# Altium project EASY-EAI-Nano-TB V1.01.PrjPcb (part 2 of 4)

## Sheet 13.WDT.SchDoc
size A4; CheckedBy: YPC; DocumentNumber: 13; Revision: V1.00; SheetNumber: 13; SheetTotal: 18; SheetName: WDT; SheetDescribe: SheetDescribe; Designer: JOW; DesignDate: 2025-04-10; CheckedData: 2025-04-10
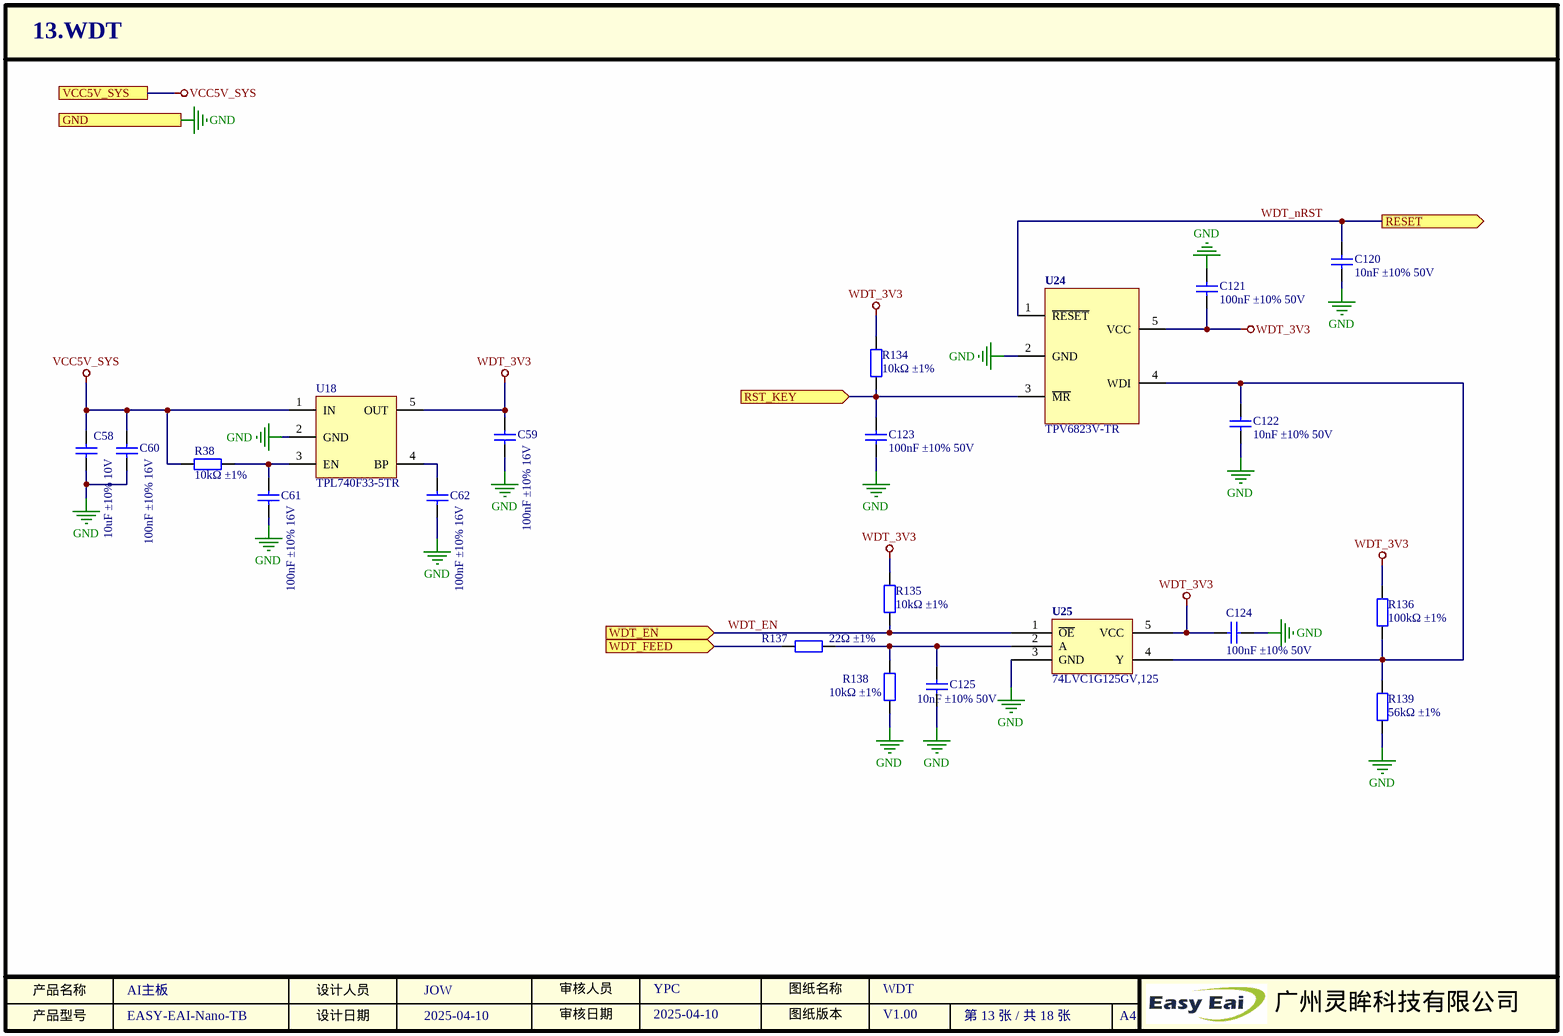
[diagram p5: 13.WDT.SchDoc]

### Parts
C58  描述: 10uF ±10% 10V  [0603_C]  (hidden comment: CL10A106KP8NNNC)
C59  描述: 100nF ±10% 16V  [0402_C]  (hidden comment: CL05B104KO5NNNC)
C60  描述: 100nF ±10% 16V  [0402_C]  (hidden comment: CL05B104KO5NNNC)
C61  描述: 100nF ±10% 16V  [0402_C]  (hidden comment: CL05B104KO5NNNC)
C62  描述: 100nF ±10% 16V  [0402_C]  (hidden comment: CL05B104KO5NNNC)  (no BOM)
C120  描述: 10nF ±10% 50V  [0402_C]  (hidden comment: CL05B103KB5NNNC)
C121  描述: 100nF ±10% 50V  [0402_C]  (hidden comment: GRM155R71H104KE14D)
C122  描述: 10nF ±10% 50V  [0402_C]  (hidden comment: CL05B103KB5NNNC)
C123  描述: 100nF ±10% 50V  [0402_C]  (hidden comment: GRM155R71H104KE14D)
C124  描述: 100nF ±10% 50V  [0402_C]  (hidden comment: GRM155R71H104KE14D)
C125  描述: 10nF ±10% 50V  [0402_C]  (hidden comment: CL05B103KB5NNNC)
R38  描述: 10kΩ ±1%  [0402_R]  (hidden comment: 0402WGF1002TCE)
R134  描述: 10kΩ ±1%  [0402_R]  (hidden comment: 0402WGF1002TCE)
R135  描述: 10kΩ ±1%  [0402_R]  (hidden comment: 0402WGF1002TCE)
R136  描述: 100kΩ ±1%  [0402_R]  (hidden comment: 0402WGF1003TCE)
R137  描述: 22Ω ±1%  [0402_R]  (hidden comment: 0402WGF220JTCE)
R138  描述: 10kΩ ±1%  [0402_R]  (hidden comment: 0402WGF1002TCE)
R139  描述: 56kΩ ±1%  [0402_R]  (hidden comment: 0402WGF5602TCE)
U18  TPL740F33-5TR  [SOT-23-5]
U24  TPV6823V-TR  [SOT-23-5]
U25  74LVC1G125GV,125  [SOT-23-5]

### Ports
GND, RESET (out), RST_KEY (in), VCC5V_SYS, WDT_EN (in), WDT_FEED (in)

### Nets
GND: C58.1 C59.1 C60.1 C61.1 C62.1 C120.1 C121.2 C122.1 C123.2 C124.1 C125.1 R138.1 R139.1 U18.2(GND) U24.2(GND) U25.3(GND) ; port GND  [project net CHIP_GND]
VCC5V_SYS: C58.2 C60.2 R38.1 U18.1(IN) ; port VCC5V_SYS
WDT_3V3: C59.2 C121.1 C124.2 R134.2 R135.2 R136.2 U18.5(OUT) U24.5(VCC) U25.5(VCC)
WDT_EN: R135.1 U25.1(~{OE}) ; port WDT_EN
WDT_nRST: C120.2 U24.1(~{RESET}) ; port RESET  [project net RESET]
NetC61_2: C61.2 R38.2 U18.3(EN)
NetC62_2: C62.2 U18.4(BP)
NetC122_2: C122.2 R136.1 R139.2 U24.4(WDI) U25.4(Y)
NetC123_1: C123.1 R134.1 U24.3(~{MR}) ; port RST_KEY
NetC125_2: C125.2 R137.2 R138.2 U25.2(A)
NetR137_1: R137.1 ; port WDT_FEED

### Notes on the sheet
- 产品名称
- 产品型号
- 设计人员
- 设计日期
- 审核人员
- 审核日期
- 图纸版本
- 图纸名称
- A4
- 广州灵眸科技有限公司

### Library data of the parts
C58 = 0603 10uF ±10% 10V: as C134 on sheet 14.Power_DCIN; 型号: CL10A106KP8NNNC; SuppliersPartNumber: C19702; 商品编号: SPZL000260
C59-C62 = 0402 100nF ±10% 16V: as C131 on sheet 14.Power_DCIN; 型号: CL05B104KO5NNNC; SuppliersPartNumber: C1525; 商品编号: SPZL000259
C120 C122 C125 = 0402 10nF ±10% 50V: as C130 on sheet 14.Power_DCIN; 型号: CL05B103KB5NNNC; SuppliersPartNumber: C15195; 商品编号: SPZL000342
C121 C123 C124 = 0402 100nF ±10% 50V: SPZL001162; 名称: 贴片电容; 厂商: muRata(村田); 封装: 0402; 工作温度: -55~125℃; 贴片和直插: SMD; 型号: GRM155R71H104KE14D; SuppliersPartNumber: C77020; 商品编号: SPZL001162
R38 R134 R135 R138 = 0402 10kΩ ±1%: as R141 on sheet 14.Power_DCIN; SuppliersPartNumber: C25744; 型号: 0402WGF1002TCE; 商品编号: SPZL000271
R136 = 0402 100kΩ ±1%: as R144 on sheet 14.Power_DCIN; SuppliersPartNumber: C25741; 型号: 0402WGF1003TCE; 商品编号: SPZL000282
R137 = 0402 22Ω ±1%: SPZL000279; 封装: 0402; 厂商: UNI-ROYAL(厚声); 贴片和直插: SMD; 名称: 电阻; 工作温度: -55~155℃; SuppliersPartNumber: C25092; 型号: 0402WGF220JTCE; 商品编号: SPZL000279
R139 = 0402 56kΩ ±1%: SPZL000395; 封装: 0402; 厂商: UNI-ROYAL(厚声); 贴片和直插: SMD; 名称: 电阻; 工作温度: -55~155℃; SuppliersPartNumber: C25796; 型号: 0402WGF5602TCE; 商品编号: SPZL000395
U18 = TPL740F33-5TR: SPZL000784; 名称: 电源IC; 厂商: 3PEAK; 贴片和直插: SMD; 描述: LDO; 工作温度: -40~85℃; 封装: SOT-23-5; SuppliersPartNumber: *; 商品编号: SPZL000784; 型号: TPL740F33-5TR
U24 = TPV6823V-TR: SPZL000751; 名称: IC; 封装: SOT23-5; 厂商: 3PEAK; 贴片和直插: SMD; 描述: 1.8V看门狗芯片; 工作温度: -40~125℃; 商品编号: SPZL000751; 型号: TPV6823V-TR
U25 = 74LVC1G125GV,125: SPZL000608; 名称: IC; 封装: SOT-753; 厂商: Nexperia(安世); 贴片和直插: SMD; 描述: 缓冲器; 工作温度: -40~85℃; SuppliersPartNumber: C12518; 商品编号: SPZL000608; 型号: 74LVC1G125GV,125

## Sheet 17.Other.SchDoc
size A4; CheckedBy: YPC; DocumentNumber: 17; Revision: V1.00; SheetNumber: 17; SheetTotal: 18; SheetName: Other; SheetDescribe: other; Designer: JOW; DesignDate: 2025-04-25; CheckedData: 2025-04-25
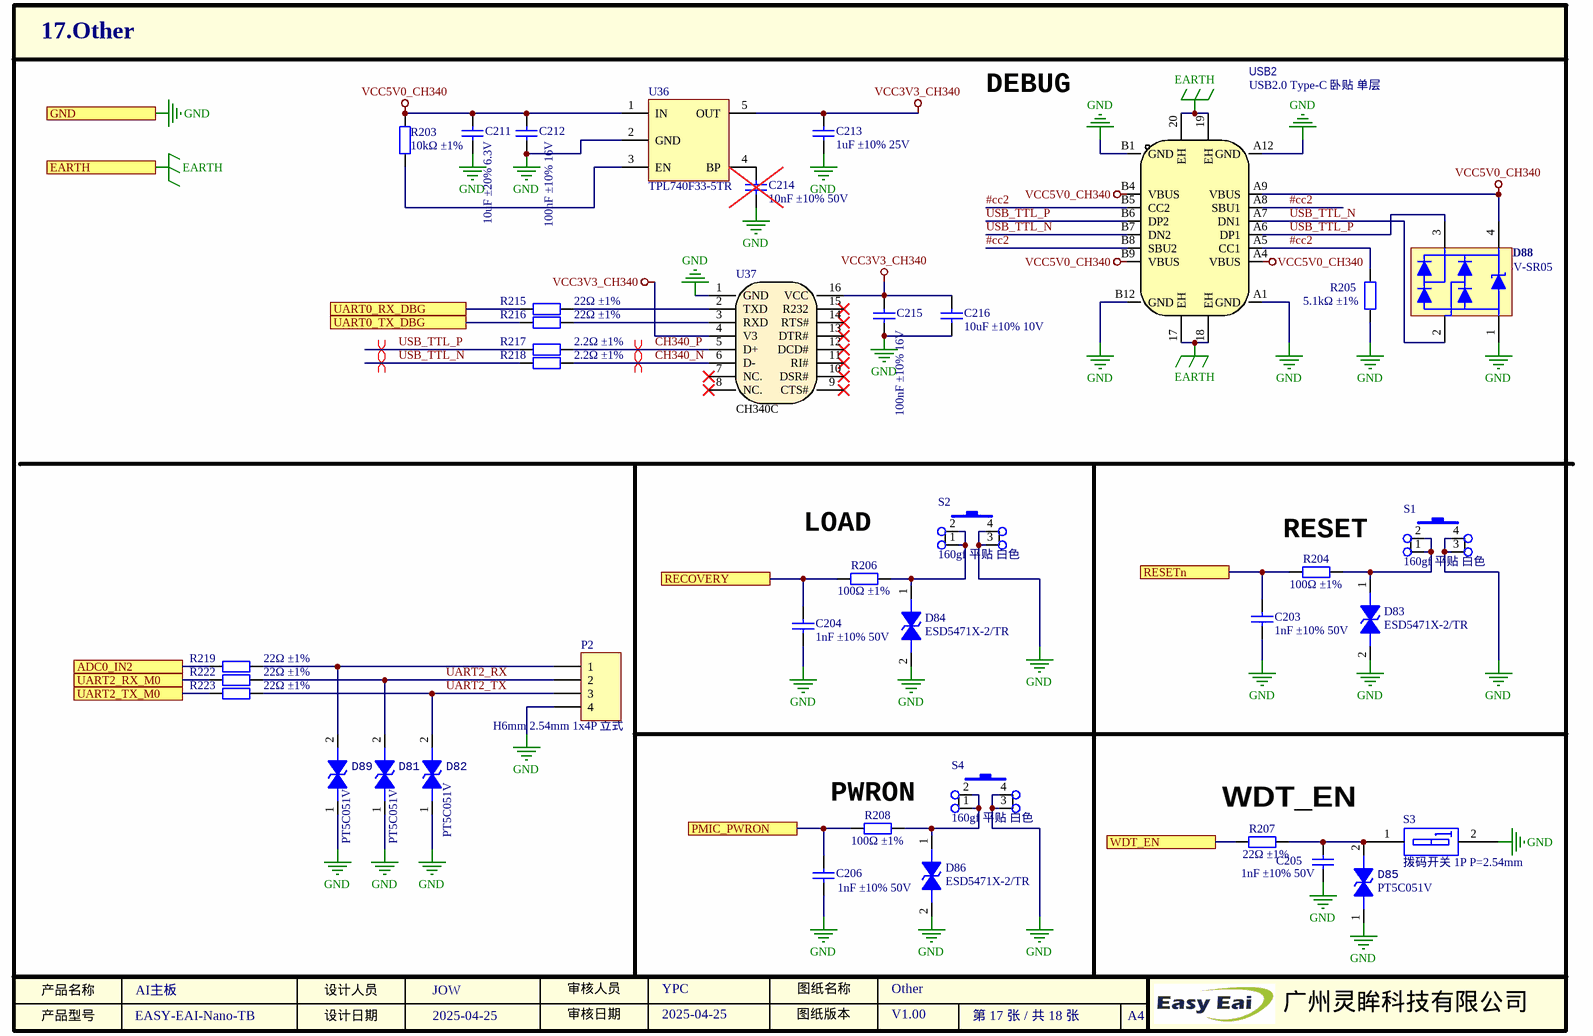
[diagram p6: 17.Other.SchDoc]

### Parts
C203  描述: 1nF ±10% 50V  [0402_C]  (hidden comment: 0402B102K500NT)
C204  描述: 1nF ±10% 50V  [0402_C]  (hidden comment: 0402B102K500NT)
C205  描述: 1nF ±10% 50V  [0402_C]  (hidden comment: 0402B102K500NT)
C206  描述: 1nF ±10% 50V  [0402_C]  (hidden comment: 0402B102K500NT)
C211  描述: 10uF ±20% 6.3V  [0402_C]  (hidden comment: CL05A106MQ5NUNC)
C212  描述: 100nF ±10% 16V  [0402_C]  (hidden comment: CL05B104KO5NNNC)
C213  描述: 1uF ±10% 25V  [0402_C]  (hidden comment: CL05A105KA5NQNC)
C214  描述: 10nF ±10% 50V  [0402_C]  (hidden comment: NC/CL05B103KB5NNNC)  (no BOM)
C215  描述: 100nF ±10% 16V  [0402_C]  (hidden comment: CL05B104KO5NNNC)
C216  描述: 10uF ±10% 10V  [0603_C]  (hidden comment: CL10A106KP8NNNC)
D81  PT5C051V  [SOD-523]
D82  PT5C051V  [SOD-523]
D83  ESD5471X-2/TR  [FBP-02C]
D84  ESD5471X-2/TR  [FBP-02C]
D85  PT5C051V  [SOD-523]
D86  ESD5471X-2/TR  [FBP-02C]
D88  BV-SR05  [SOT-143]
D89  PT5C051V  [SOD-523]
P2  描述: H6mm 2.54mm 1x4P 立式  [HDR-TH_4P-P2.54-V-M]  (hidden comment: 2.54-1x4P直针)
R203  描述: 10kΩ ±1%  [0402_R]  (hidden comment: 0402WGF1002TCE)
R204  描述: 100Ω ±1%  [0402_R]  (hidden comment: 0402WGF1000TCE)
R205  描述: 5.1kΩ ±1%  [0402_R]  (hidden comment: 0402WGF5101TCE)
R206  描述: 100Ω ±1%  [0402_R]  (hidden comment: 0402WGF1000TCE)
R207  描述: 22Ω ±1%  [0402_R]  (hidden comment: 0402WGF220JTCE)
R208  描述: 100Ω ±1%  [0402_R]  (hidden comment: 0402WGF1000TCE)
R215  描述: 22Ω ±1%  [0402_R]  (hidden comment: 0402WGF220JTCE)
R216  描述: 22Ω ±1%  [0402_R]  (hidden comment: 0402WGF220JTCE)
R217  描述: 2.2Ω ±1%  [0402_R]  (hidden comment: 0402WGF220KTCE)
R218  描述: 2.2Ω ±1%  [0402_R]  (hidden comment: 0402WGF220KTCE)
R219  描述: 22Ω ±1%  [0402_R]  (hidden comment: 0402WGF220JTCE)
R222  描述: 22Ω ±1%  [0402_R]  (hidden comment: 0402WGF220JTCE)
R223  描述: 22Ω ±1%  [0402_R]  (hidden comment: 0402WGF220JTCE)
S1  描述: 160gf 平贴 白色  [SW-SMD_4P-L4.2-W3.2-P2.15-LS5.2]  (hidden comment: TS-1145A-B-A)
S2  描述: 160gf 平贴 白色  [SW-SMD_4P-L4.2-W3.2-P2.15-LS5.2]  (hidden comment: TS-1145A-B-A)
S3  EM-01KP  [EM-01KP]  (value not drawn)
S4  描述: 160gf 平贴 白色  [SW-SMD_4P-L4.2-W3.2-P2.15-LS5.2]  (hidden comment: TS-1145A-B-A)
U36  TPL740F33-5TR  [SOT-23-5]
U37  CH340C  [SOIC-16_150mil]
USB2  USB2.0 Type-C 卧贴 单层  [USB-TYPE-C_16PIN-MALE-TYPE-C-31-M-12]

### Ports
ADC0_IN2, EARTH, GND, PMIC_PWRON, RECOVERY, RESETn, UART0_RX_DBG, UART0_TX_DBG, UART2_RX_M0, UART2_TX_M0, WDT_EN

### Nets
EARTH: USB2.17(EH) USB2.18(EH) USB2.19(EH) USB2.20(EH) ; port EARTH
GND: C203.1 C204.1 C205.1 C206.1 C211.1 C212.1 C213.1 C214.1 C215.1 C216.1 D81.1 D82.1 D83.2 D84.2 D85.1 D86.2 D88.1 D89.1 P2.4 R205.1 S1.3 S1.4 S2.3 S2.4 S3.2 S4.3 S4.4 U36.2(GND) U37.1(GND) USB2.A1(GND) USB2.A12(GND) USB2.B1(GND) USB2.B12(GND) ; port GND  [project net CHIP_GND]
VCC3V3_CH340: C213.2 C215.2 C216.2 U36.5(OUT) U37.4(V3) U37.16(VCC)
VCC5V0_CH340: C211.2 C212.2 D88.4 R203.2 U36.1(IN) USB2.A4(VBUS) USB2.A9(VBUS) USB2.B4(VBUS) USB2.B9(VBUS)
#cc2: R205.2 USB2.A5(CC1) USB2.A8(SBU1) USB2.B5(CC2) USB2.B8(SBU2)
CH340_N: R218.2 U37.6(D-)
CH340_P: R217.2 U37.5(D+)
UART0_RX_DBG: R215.1 ; port UART0_RX_DBG
UART0_TX_DBG: R216.1 ; port UART0_TX_DBG
UART2_RX: D81.2 P2.2 R222.2
UART2_RX_M0: R222.1 ; port UART2_RX_M0
UART2_TX: D82.2 P2.3 R223.2
UART2_TX_M0: R223.1 ; port UART2_TX_M0
USB_TTL_N: D88.2 R218.1 USB2.A7(DN1) USB2.B7(DN2)
USB_TTL_P: D88.3 R217.1 USB2.A6(DP1) USB2.B6(DP2)
WDT_EN: R207.1 ; port WDT_EN
NetC203_2: C203.2 R204.1 ; port RESETn
NetC204_2: C204.2 R206.1 ; port RECOVERY
NetC205_2: C205.2 D85.2 R207.2 S3.1
NetC206_2: C206.2 R208.1 ; port PMIC_PWRON
NetC214_2: C214.2 U36.4(BP)
NetD83_1: D83.1 R204.2 S1.1 S1.2
NetD84_1: D84.1 R206.2 S2.1 S2.2
NetD86_1: D86.1 R208.2 S4.1 S4.2
NetD89_2: D89.2 P2.1 R219.2
NetR203_1: R203.1 U36.3(EN)
NetR215_2: R215.2 U37.2(TXD)
NetR216_2: R216.2 U37.3(RXD)
NetR219_1: R219.1 ; port ADC0_IN2

Not connected (* = marked no-connect by the designer): U37 7(NC.)* 8(NC.)* 9(CTS#)* 10(DSR#)* 11(RI#)* 12(DCD#)* 13(DTR#)* 14(RTS#)* 15(R232)*

### Layout directives
differential pair: CH340_N, CH340_P, USB_TTL_N, USB_TTL_P

### Notes on the sheet
- DEBUG
- (near R206) LOAD
- (near R204) RESET
- (near R208) PWRON
- WDT_EN
- 产品名称
- 产品型号
- 设计人员
- 设计日期
- 审核人员
- 审核日期
- 图纸版本
- 图纸名称
- A4
- 广州灵眸科技有限公司

### Library data of the parts
C203-C206 = 0402 1nF ±10% 50V: SPZL000264; 名称: 贴片电容; 厂商: FH(风华); 封装: 0402; 工作温度: -55~125℃; 贴片和直插: SMD; 型号: 0402B102K500NT; SuppliersPartNumber: C1523; 商品编号: SPZL000264
C211 = 0402 10uF ±20% 6.3V: SPZL000269; 名称: 贴片电容; 厂商: SAMSUNG(三星); 封装: 0402; 工作温度: -55~85℃; 贴片和直插: SMD; 型号: CL05A106MQ5NUNC; SuppliersPartNumber: C15525; 商品编号: SPZL000269
C212 C215 = 0402 100nF ±10% 16V: SPZL000259; 名称: 贴片电容; 厂商: SAMSUNG(三星); 封装: 0402; 工作温度: -55~125℃; 贴片和直插: SMD; 型号: CL05B104KO5NNNC; SuppliersPartNumber: C1525; 商品编号: SPZL000259
C213 = 0402 1uF ±10% 25V: SPZL000337; 名称: 贴片电容; 厂商: SAMSUNG(三星); 封装: 0402; 工作温度: -55~85℃; 贴片和直插: SMD; 型号: CL05A105KA5NQNC; SuppliersPartNumber: C52923; 商品编号: SPZL000337
C214 = 0402 10nF ±10% 50V: SPZL000342; 名称: 贴片电容; 厂商: SAMSUNG(三星); 封装: 0402; 工作温度: -55~125℃; 贴片和直插: SMD; 型号: CL05B103KB5NNNC; SuppliersPartNumber: C15195; 商品编号: SPZL000342
C216 = 0603 10uF ±10% 10V: SPZL000260; 名称: 贴片电容; 厂商: SAMSUNG(三星); 封装: 0603; 工作温度: -55~85℃; 贴片和直插: SMD; 型号: CL10A106KP8NNNC; SuppliersPartNumber: C19702; 商品编号: SPZL000260
D81 D82 D85 D89 = PT5C051V: SPZL001155; 名称: ESD; 贴片和直插: SMD; 厂商: 玛珂斯科技; 描述: Vrwm=5V,Vc=25V,Ipp=5A; 工作温度: -55~125℃; 封装: SOD-523; 商品编号: SPZL001155; 型号: PT5C051V
D83 D84 D86 = TVS ESD5471X-2/TR: SPZL000254; 名称: TVS; 贴片和直插: SMD; 厂商: WillSemi(韦尔半导体); 描述: Vdrm=5V Cj=9pF; 工作温度: -40~85℃; SuppliersPartNumber: C239631; 封装: FBP-02C; 商品编号: SPZL000254; 型号: ESD5471X-2/TR
D88 = TVS BV-SR05: SPZL000616; 名称: TVS; 厂商: Bencent(槟城); 贴片和直插: SMD; 描述: Vdrm=5V Cj=0.85pF; 工作温度: -40~125℃; 封装: SOT-143; SuppliersPartNumber: C413946; 商品编号: SPZL000616; 型号: BV-SR05
P2 = 排针 H6mm 2.54mm 1x4P 立式: SPZL001463; 名称: 排针; 贴片和直插: THT; 厂商: XFCN(兴飞); 封装: 插件,P=2.54mm; 工作温度: -40~105℃; 型号: 2.54-1x4P直针; 商品编号: SPZL001463; SuppliersPartNumber: C2691448
R203 = 0402 10kΩ ±1%: SPZL000271; 封装: 0402; 厂商: UNI-ROYAL(厚声); 贴片和直插: SMD; 名称: 电阻; 工作温度: -55~155℃; SuppliersPartNumber: C25744; 型号: 0402WGF1002TCE; 商品编号: SPZL000271
R204 R206 R208 = 0402 100Ω ±1%: SPZL000281; 封装: 0402; 厂商: UNI-ROYAL(厚声); 贴片和直插: SMD; 名称: 电阻; 工作温度: -55~155℃; SuppliersPartNumber: C25076; 型号: 0402WGF1000TCE; 商品编号: SPZL000281
R205 = 0402 5.1kΩ ±1%: SPZL000270; 封装: 0402; 厂商: UNI-ROYAL(厚声); 贴片和直插: SMD; 名称: 电阻; 工作温度: -55~155℃; SuppliersPartNumber: C25905; 型号: 0402WGF5101TCE; 商品编号: SPZL000270
R207 R215 R216 R219 R222 R223 = 0402 22Ω ±1%: SPZL000279; 封装: 0402; 厂商: UNI-ROYAL(厚声); 贴片和直插: SMD; 名称: 电阻; 工作温度: -55~155℃; SuppliersPartNumber: C25092; 型号: 0402WGF220JTCE; 商品编号: SPZL000279
R217 R218 = 0402 2.2Ω ±1%: SPZL000327; 封装: 0402; 厂商: UNI-ROYAL(厚声); 贴片和直插: SMD; 名称: 电阻; 工作温度: -55~155℃; SuppliersPartNumber: C25101; 型号: 0402WGF220KTCE; 商品编号: SPZL000327
S1 S2 S4 = 轻触开关 3.2X4.2X2.5mm: SPZL000455; 名称: 轻触开关; 贴片和直插: SMD; 厂商: XKB Connectivity; 封装: SMD 3.2X4.2X2.5mm; 工作温度: -30~85℃; SuppliersPartNumber: C318904; 型号: TS-1145A-B-A; 商品编号: SPZL000455
S3 = 拨码开关 1P P=2.54mm: SPZL000149; 名称: 拨码开关; 贴片和直插: SMD; 厂商: 韩国韩荣; 封装: SMD,2.5x6mm; 工作温度: -20~70℃; SuppliersPartNumber: C129077; 型号: EM-01KP; 商品编号: SPZL000149; 描述: 拨码开关 1P P=2.54mm
U36 = TPL740F33-5TR: SPZL000784; 名称: 电源IC; 厂商: 3PEAK; 贴片和直插: SMD; 描述: LDO; 工作温度: -40~85℃; 封装: SOT-23-5; SuppliersPartNumber: *; 商品编号: SPZL000784; 型号: TPL740F33-5TR
U37 = CH340C: SPZL000072; 名称: IC; 封装: SOP-16_150mil; 描述: USB/TTL; 厂商: WCH(南京沁恒); 贴片和直插: SMD; 工作温度: -20~70℃; 商品编号: SPZL000072; SuppliersPartNumber: C84681; 型号: CH340C
USB2 = USB2.0 Type-C 卧贴 单层: SPZL000132; 厂商: 韩国韩荣; 名称: USB连接器; 封装: SMD; 型号: TYPE-C-31-M-12; 贴片和直插: SMD; 商品编号: SPZL000132; SuppliersPartNumber: C165948; 描述: USB2.0 Type-C 卧贴 单层

## Sheet 05.Audio.SchDoc
size A4; CheckedBy: YPC; DocumentNumber: 5; Revision: V1.00; SheetNumber: 05; SheetTotal: 18; SheetName: Audio; SheetDescribe: SheetDescribe; Designer: JOW; DesignDate: 2025-04-25; CheckedData: 2025-04-25
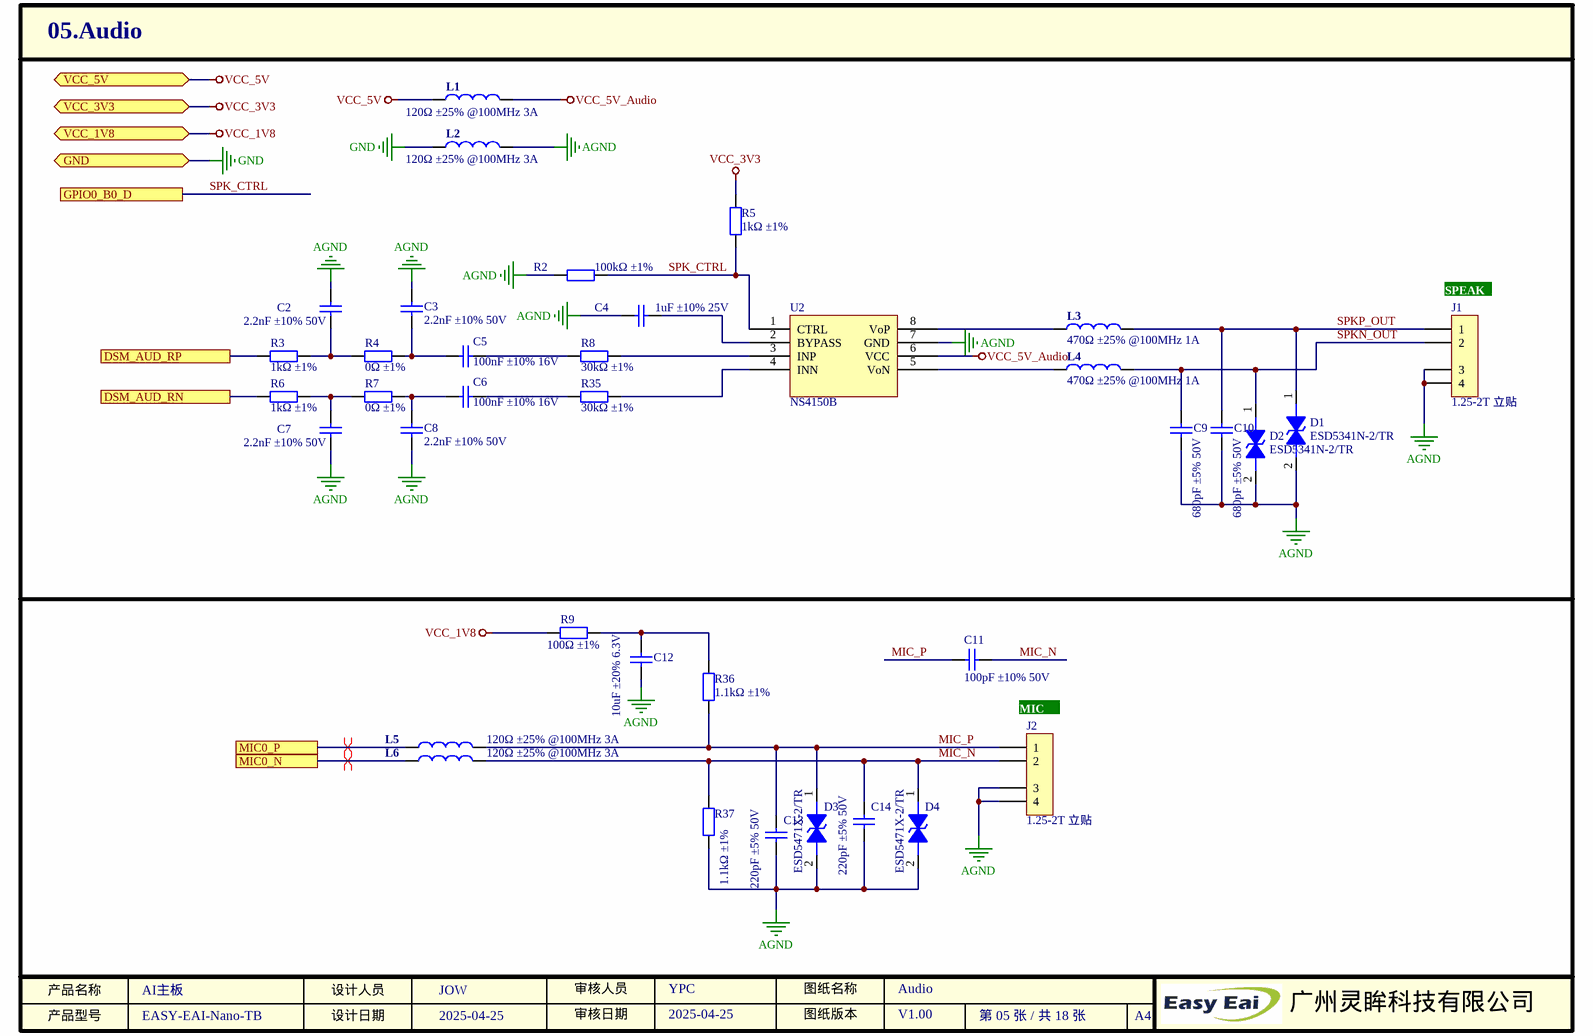
[diagram p7: 05.Audio.SchDoc]

### Parts
C2  描述: 2.2nF ±10% 50V  [0402_C]  (hidden comment: 0402B222K500NT)
C3  描述: 2.2nF ±10% 50V  [0402_C]  (hidden comment: 0402B222K500NT)  (no BOM)
C4  描述: 1uF ±10% 25V  [0402_C]  (hidden comment: CL05A105KA5NQNC)
C5  描述: 100nF ±10% 16V  [0402_C]  (hidden comment: CL05B104KO5NNNC)
C6  描述: 100nF ±10% 16V  [0402_C]  (hidden comment: CL05B104KO5NNNC)
C7  描述: 2.2nF ±10% 50V  [0402_C]  (hidden comment: 0402B222K500NT)
C8  描述: 2.2nF ±10% 50V  [0402_C]  (hidden comment: 0402B222K500NT)  (no BOM)
C9  描述: 680pF ±5% 50V  [0402_C]  (hidden comment: CL05C681JB5NNNC)
C10  描述: 680pF ±5% 50V  [0402_C]  (hidden comment: CL05C681JB5NNNC)
C11  描述: 100pF ±10% 50V  [0402_C]  (hidden comment: CC0402KRX7R9BB101)
C12  描述: 10uF ±20% 6.3V  [0402_C]  (hidden comment: CL05A106MQ5NUNC)
C13  描述: 220pF ±5% 50V  [0402_C]  (hidden comment: GCM1555G1H221JA16D)
C14  描述: 220pF ±5% 50V  [0402_C]  (hidden comment: GCM1555G1H221JA16D)
D1  ESD5341N-2/TR  [DFN1006-2L]
D2  ESD5341N-2/TR  [DFN1006-2L]
D3  ESD5471X-2/TR  [FBP-02C]
D4  ESD5471X-2/TR  [FBP-02C]
J1  AFC12-S02CCA-00  [1.25-2T_SMD_L]  (value not drawn)
J2  AFC12-S02CCA-00  [1.25-2T_SMD_L]  (value not drawn)
L1  BLM18KG121TN1D  [0603_R]  (value not drawn)
L2  BLM18KG121TN1D  [0603_R]  (value not drawn)
L3  PZ1608U471-1R0TF  [0603_R]  (value not drawn)
L4  PZ1608U471-1R0TF  [0603_R]  (value not drawn)
L5  BLM18KG121TN1D  [0603_R]  (value not drawn)
L6  BLM18KG121TN1D  [0603_R]  (value not drawn)
R2  描述: 100kΩ ±1%  [0402_R]  (hidden comment: 0402WGF1003TCE)
R3  描述: 1kΩ ±1%  [0402_R]  (hidden comment: 0402WGF1001TCE)
R4  描述: 0Ω ±1%  [0402_R]  (hidden comment: 0402WGF0000TCE)
R5  描述: 1kΩ ±1%  [0402_R]  (hidden comment: 0402WGF1001TCE)
R6  描述: 1kΩ ±1%  [0402_R]  (hidden comment: 0402WGF1001TCE)
R7  描述: 0Ω ±1%  [0402_R]  (hidden comment: 0402WGF0000TCE)
R8  描述: 30kΩ ±1%  [0402_R]  (hidden comment: NQ02WGF3002TCE)
R9  描述: 100Ω ±1%  [0402_R]  (hidden comment: 0402WGF1000TCE)
R35  描述: 30kΩ ±1%  [0402_R]  (hidden comment: NQ02WGF3002TCE)
R36  描述: 1.1kΩ ±1%  [0402_R]  (hidden comment: AC0402FR-071K1L)
R37  描述: 1.1kΩ ±1%  [0402_R]  (hidden comment: AC0402FR-071K1L)
U2  NS4150B  [MSOP-8]

### Ports
DSM_AUD_RN, DSM_AUD_RP, GND, GPIO0_B0_D, MIC0_N, MIC0_P, VCC_1V8, VCC_3V3, VCC_5V

### Nets
AGND: C2.2 C3.2 C4.1 C7.1 C8.1 C9.1 C10.1 C12.1 C13.1 C14.1 D1.2 D2.2 D3.2 D4.2 J1.3 J1.4 J2.3 J2.4 L2.2 R2.1 R37.1 U2.7(GND)
GND: L2.1 ; port GND  [project net CHIP_GND]
VCC_1V8: R9.1 ; port VCC_1V8
VCC_3V3: R5.2 ; port VCC_3V3  [project net VCC3V3]
VCC_5V: L1.1 ; port VCC_5V
VCC_5V_Audio: L1.2 U2.6(VCC)
DSM_AUD_RN: R6.1 ; port DSM_AUD_RN
DSM_AUD_RP: R3.1 ; port DSM_AUD_RP
MIC0_N: L6.1 ; port MIC0_N
MIC0_P: L5.1 ; port MIC0_P
MIC_N: C11.2 C14.2 D4.1 J2.2 L6.2 R37.2
MIC_P: C11.1 C13.2 D3.1 J2.1 L5.2 R36.1
SPK_CTRL: R2.2 R5.1 U2.1(CTRL) ; port GPIO0_B0_D
SPKN_OUT: C9.2 D2.1 J1.2 L4.2
SPKP_OUT: C10.2 D1.1 J1.1 L3.2
NetC2_1: C2.1 R3.2 R4.1
NetC3_1: C3.1 C5.1 R4.2
NetC4_2: C4.2 U2.2(BYPASS)
NetC5_2: C5.2 R8.1
NetC6_1: C6.1 C8.2 R7.2
NetC6_2: C6.2 R35.1
NetC7_2: C7.2 R6.2 R7.1
NetC12_2: C12.2 R9.2 R36.2
NetL3_1: L3.1 U2.8(VoP)
NetL4_1: L4.1 U2.5(VoN)
NetR8_2: R8.2 U2.3(INP)
NetR35_2: R35.2 U2.4(INN)

### Layout directives
differential pair: MIC0_N, MIC0_P

### Notes on the sheet
- (near J1) SPEAK
- (near J2) MIC
- 产品名称
- 产品型号
- 设计人员
- 设计日期
- 审核人员
- 审核日期
- 图纸版本
- 图纸名称
- A4
- 广州灵眸科技有限公司

### Library data of the parts
C2 C3 C7 C8 = 0402 2.2nF ±10% 50V: SPZL000399; 名称: 贴片电容; 厂商: FH(风华); 封装: 0402; 工作温度: -55~125℃; 贴片和直插: SMD; 型号: 0402B222K500NT; SuppliersPartNumber: C1531; 商品编号: SPZL000399
C4 = 0402 1uF ±10% 25V: as C213 on sheet 17.Other; 型号: CL05A105KA5NQNC; SuppliersPartNumber: C52923; 商品编号: SPZL000337
C5 C6 = 0402 100nF ±10% 16V: as C212 on sheet 17.Other; 型号: CL05B104KO5NNNC; SuppliersPartNumber: C1525; 商品编号: SPZL000259
C9 C10 = 0402 680pF ±5% 50V: SPZL000317; 名称: 贴片电容; 厂商: SAMSUNG(三星); 封装: 0402; 工作温度: -55~125℃; 贴片和直插: SMD; 型号: CL05C681JB5NNNC; SuppliersPartNumber: C307451; 商品编号: SPZL000317
C11 = 0402 100pF ±10% 50V: SPZL000312; 名称: 贴片电容; 厂商: YAGEO(国巨); 封装: 0402; 工作温度: -55~125℃; 贴片和直插: SMD; 型号: CC0402KRX7R9BB101; SuppliersPartNumber: C281751; 商品编号: SPZL000312
C12 = 0402 10uF ±20% 6.3V: as C211 on sheet 17.Other; 型号: CL05A106MQ5NUNC; SuppliersPartNumber: C15525; 商品编号: SPZL000269
C13 C14 = 0402 220pF ±5% 50V: SPZL000318; 名称: 贴片电容; 厂商: muRata(村田); 封装: 0402; 工作温度: -55~150℃; 贴片和直插: SMD; 型号: GCM1555G1H221JA16D; SuppliersPartNumber: C1517776; 商品编号: SPZL000318
D1 D2 = TVS ESD5341N-2/TR: SPZL000253; 名称: TVS; 贴片和直插: SMD; 厂商: WILLSEMI(韦尔); 描述: Vdrm=5V Cj=1pF; 工作温度: -40~85℃; 封装: DFN1006-2L; 商品编号: SPZL000253; SuppliersPartNumber: C239773; 型号: ESD5341N-2/TR
D3 D4 = TVS ESD5471X-2/TR: as D83 on sheet 17.Other; SuppliersPartNumber: C239631; 封装: FBP-02C; 商品编号: SPZL000254; 型号: ESD5471X-2/TR
J1 J2 = 1.25-2T 立贴: SPZL000112; 名称: 线对板/线对线连接器; 封装: SMD; 厂商: JS(钜硕电子); 工作温度: -20~85℃; 贴片和直插: SMD; SuppliersPartNumber: C466544; 型号: AFC12-S02CCA-00; 商品编号: SPZL000112; 描述: 1.25-2T 立贴
L1 L2 L5 L6 = 120Ω ±25% @100MHz 3A: SPZL000842; 名称: 磁珠; 封装: 0603; 厂商: muRata(村田); 贴片和直插: SMD; 工作温度: -40~85℃; SuppliersPartNumber: C85831; 型号: BLM18KG121TN1D; 商品编号: SPZL000842; 描述: 120Ω ±25% @100MHz 3A
L3 L4 = 470Ω ±25% @100MHz 1A: SPZL000054; 名称: 磁珠; 封装: 0603; 厂商: Sunlord(顺络); 贴片和直插: SMD; 工作温度: -55~125℃; SuppliersPartNumber: C42103; 型号: PZ1608U471-1R0TF; 商品编号: SPZL000054; 描述: 470Ω ±25% @100MHz 1A
R2 = 0402 100kΩ ±1%: SPZL000282; 封装: 0402; 厂商: UNI-ROYAL(厚声); 贴片和直插: SMD; 名称: 电阻; 工作温度: -55~155℃; SuppliersPartNumber: C25741; 型号: 0402WGF1003TCE; 商品编号: SPZL000282
R3 R5 R6 = 0402 1kΩ ±1%: SPZL000275; 封装: 0402; 厂商: UNI-ROYAL(厚声); 贴片和直插: SMD; 名称: 电阻; 工作温度: -55~125℃; SuppliersPartNumber: C11702; 型号: 0402WGF1001TCE; 商品编号: SPZL000275
R4 R7 = 0402 0Ω ±1%: SPZL000276; 封装: 0402; 厂商: UNI-ROYAL(厚声); 贴片和直插: SMD; 名称: 电阻; 工作温度: -55~125℃; SuppliersPartNumber: C17168; 型号: 0402WGF0000TCE; 商品编号: SPZL000276
R8 R35 = 0402 30kΩ ±1%: SPZL000323; 封装: 0402; 厂商: UNI-ROYAL(厚声); 贴片和直插: SMD; 名称: 电阻; 工作温度: -55~155℃; SuppliersPartNumber: C965267; 型号: NQ02WGF3002TCE; 商品编号: SPZL000323
R9 = 0402 100Ω ±1%: as R204 on sheet 17.Other; SuppliersPartNumber: C25076; 型号: 0402WGF1000TCE; 商品编号: SPZL000281
R36 R37 = 0402 1.1kΩ ±1%: SPZL000324; 封装: 0402; 厂商: YAGEO(国巨); 贴片和直插: SMD; 名称: 电阻; 工作温度: -55~125℃; SuppliersPartNumber: C226844; 型号: AC0402FR-071K1L; 商品编号: SPZL000324
U2 = NS4150B: SPZL000086; 名称: IC; 厂商: Nsiway(纳芯威); 贴片和直插: SMD; 规格: 3W单声道D类音频功放; 工作温度: -40~85℃; 封装: MSOP-8; SuppliersPartNumber: C189961; 商品编号: SPZL000086; 型号: NS4150B

## Sheet 06.MIPI_CSI_Camera.SchDoc
size A3; CheckedBy: YPC; DocumentNumber: 6; Revision: V1.00; SheetNumber: 06; SheetTotal: 18; SheetName: MIPI_CSI_Camera; SheetDescribe: MIPI_CSI连接器接口子图; Designer: JOW; DesignDate: 2025-04-25; CheckedData: 2025-04-25; Rule: PcbType=ProtelPcb
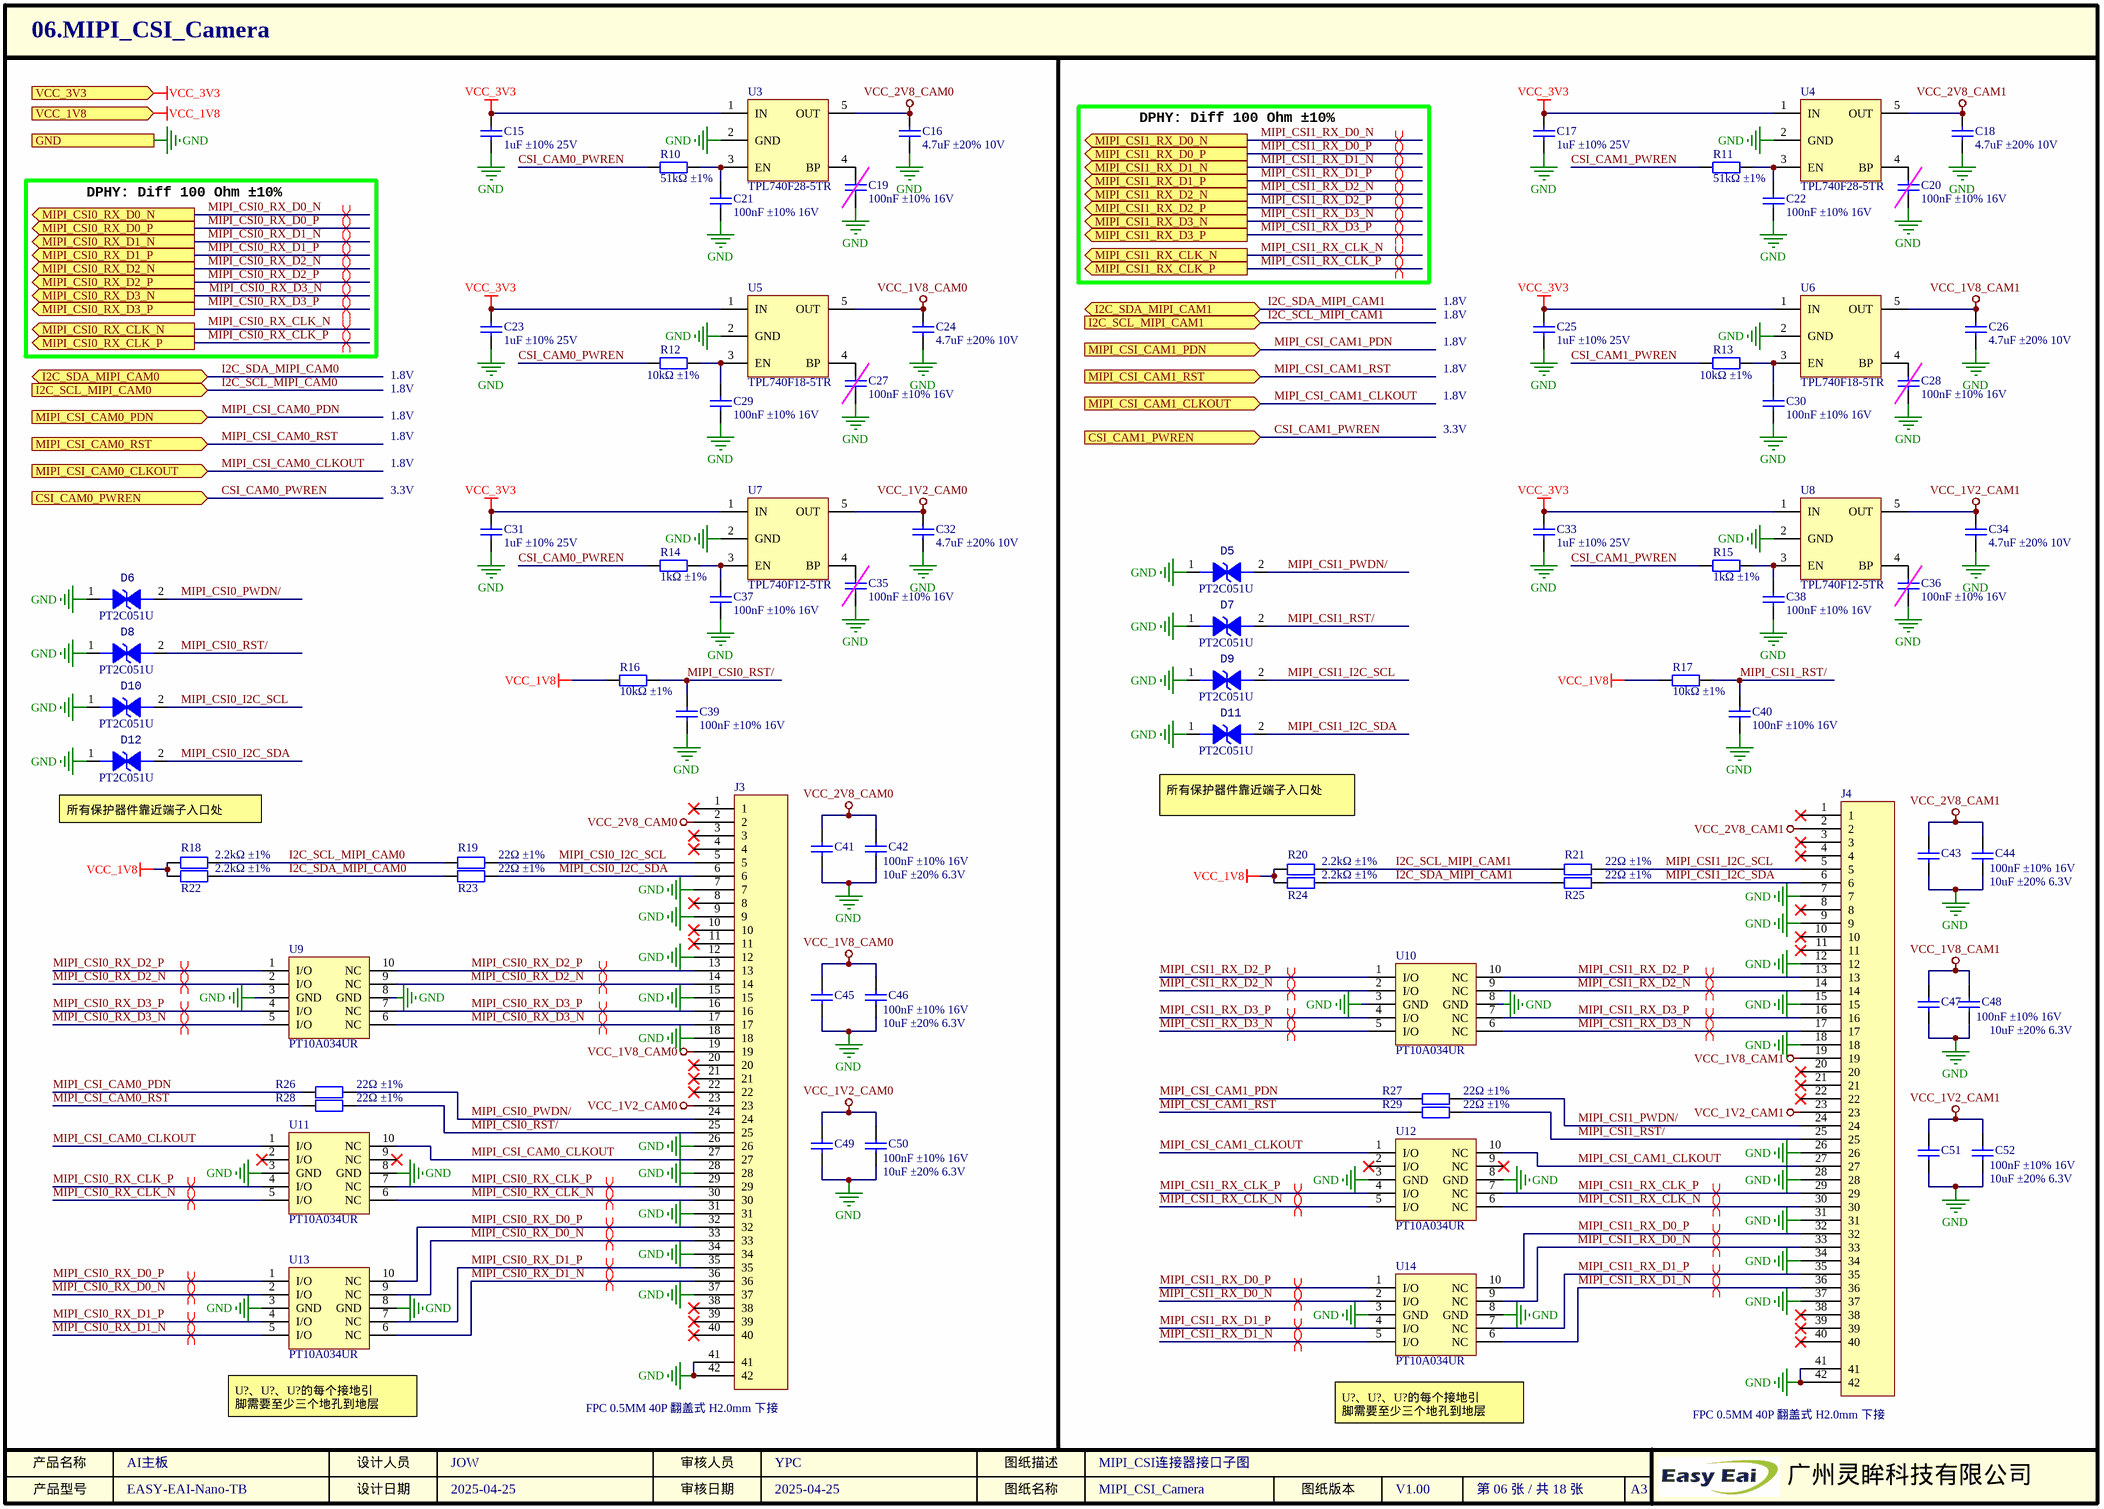
[diagram p8: 06.MIPI_CSI_Camera.SchDoc]

### Parts
C15  描述: 1uF ±10% 25V  [0402_C]  (hidden comment: CL05A105KA5NQNC)
C16  描述: 4.7uF ±20% 10V  [0402_C]  (hidden comment: CL05A475MP5NRNC)
C17  描述: 1uF ±10% 25V  [0402_C]  (hidden comment: CL05A105KA5NQNC)
C18  描述: 4.7uF ±20% 10V  [0402_C]  (hidden comment: CL05A475MP5NRNC)
C19  描述: 100nF ±10% 16V  [0402_C]  (hidden comment: CL05B104KO5NNNC)  (no BOM)
C20  描述: 100nF ±10% 16V  [0402_C]  (hidden comment: CL05B104KO5NNNC)  (no BOM)
C21  描述: 100nF ±10% 16V  [0402_C]  (hidden comment: CL05B104KO5NNNC)
C22  描述: 100nF ±10% 16V  [0402_C]  (hidden comment: CL05B104KO5NNNC)
C23  描述: 1uF ±10% 25V  [0402_C]  (hidden comment: CL05A105KA5NQNC)
C24  描述: 4.7uF ±20% 10V  [0402_C]  (hidden comment: CL05A475MP5NRNC)
C25  描述: 1uF ±10% 25V  [0402_C]  (hidden comment: CL05A105KA5NQNC)
C26  描述: 4.7uF ±20% 10V  [0402_C]  (hidden comment: CL05A475MP5NRNC)
C27  描述: 100nF ±10% 16V  [0402_C]  (hidden comment: CL05B104KO5NNNC)  (no BOM)
C28  描述: 100nF ±10% 16V  [0402_C]  (hidden comment: CL05B104KO5NNNC)  (no BOM)
C29  描述: 100nF ±10% 16V  [0402_C]  (hidden comment: CL05B104KO5NNNC)
C30  描述: 100nF ±10% 16V  [0402_C]  (hidden comment: CL05B104KO5NNNC)
C31  描述: 1uF ±10% 25V  [0402_C]  (hidden comment: CL05A105KA5NQNC)
C32  描述: 4.7uF ±20% 10V  [0402_C]  (hidden comment: CL05A475MP5NRNC)
C33  描述: 1uF ±10% 25V  [0402_C]  (hidden comment: CL05A105KA5NQNC)
C34  描述: 4.7uF ±20% 10V  [0402_C]  (hidden comment: CL05A475MP5NRNC)
C35  描述: 100nF ±10% 16V  [0402_C]  (hidden comment: CL05B104KO5NNNC)  (no BOM)
C36  描述: 100nF ±10% 16V  [0402_C]  (hidden comment: CL05B104KO5NNNC)  (no BOM)
C37  描述: 100nF ±10% 16V  [0402_C]  (hidden comment: CL05B104KO5NNNC)
C38  描述: 100nF ±10% 16V  [0402_C]  (hidden comment: CL05B104KO5NNNC)
C39  描述: 100nF ±10% 16V  [0402_C]  (hidden comment: CL05B104KO5NNNC)
C40  描述: 100nF ±10% 16V  [0402_C]  (hidden comment: CL05B104KO5NNNC)
C41  描述: 10uF ±20% 6.3V  [0402_C]  (hidden comment: CL05A106MQ5NUNC)
C42  描述: 100nF ±10% 16V  [0402_C]  (hidden comment: CL05B104KO5NNNC)
C43  描述: 10uF ±20% 6.3V  [0402_C]  (hidden comment: CL05A106MQ5NUNC)
C44  描述: 100nF ±10% 16V  [0402_C]  (hidden comment: CL05B104KO5NNNC)
C45  描述: 10uF ±20% 6.3V  [0402_C]  (hidden comment: CL05A106MQ5NUNC)
C46  描述: 100nF ±10% 16V  [0402_C]  (hidden comment: CL05B104KO5NNNC)
C47  描述: 10uF ±20% 6.3V  [0402_C]  (hidden comment: CL05A106MQ5NUNC)
C48  描述: 100nF ±10% 16V  [0402_C]  (hidden comment: CL05B104KO5NNNC)
C49  描述: 10uF ±20% 6.3V  [0402_C]  (hidden comment: CL05A106MQ5NUNC)
C50  描述: 100nF ±10% 16V  [0402_C]  (hidden comment: CL05B104KO5NNNC)
C51  描述: 10uF ±20% 6.3V  [0402_C]  (hidden comment: CL05A106MQ5NUNC)
C52  描述: 100nF ±10% 16V  [0402_C]  (hidden comment: CL05B104KO5NNNC)
D5  PT2C051U  [DFN1006]
D6  PT2C051U  [DFN1006]
D7  PT2C051U  [DFN1006]
D8  PT2C051U  [DFN1006]
D9  PT2C051U  [DFN1006]
D10  PT2C051U  [DFN1006]
D11  PT2C051U  [DFN1006]
D12  PT2C051U  [DFN1006]
J3  AFC01-S40FCA-00  [FFC0.5-40P]  (value not drawn)
J4  AFC01-S40FCA-00  [FFC0.5-40P]  (value not drawn)
R10  描述: 51kΩ ±1%  [0402_R]  (hidden comment: 0402WGF5102TCE)
R11  描述: 51kΩ ±1%  [0402_R]  (hidden comment: 0402WGF5102TCE)
R12  描述: 10kΩ ±1%  [0402_R]  (hidden comment: 0402WGF1002TCE)
R13  描述: 10kΩ ±1%  [0402_R]  (hidden comment: 0402WGF1002TCE)
R14  描述: 1kΩ ±1%  [0402_R]  (hidden comment: 0402WGF1001TCE)
R15  描述: 1kΩ ±1%  [0402_R]  (hidden comment: 0402WGF1001TCE)
R16  描述: 10kΩ ±1%  [0402_R]  (hidden comment: 0402WGF1002TCE)
R17  描述: 10kΩ ±1%  [0402_R]  (hidden comment: 0402WGF1002TCE)
R18  描述: 2.2kΩ ±1%  [0402_R]  (hidden comment: AC0402FR-072K2L)
R19  描述: 22Ω ±1%  [0402_R]  (hidden comment: 0402WGF220JTCE)
R20  描述: 2.2kΩ ±1%  [0402_R]  (hidden comment: AC0402FR-072K2L)
R21  描述: 22Ω ±1%  [0402_R]  (hidden comment: 0402WGF220JTCE)
R22  描述: 2.2kΩ ±1%  [0402_R]  (hidden comment: AC0402FR-072K2L)
R23  描述: 22Ω ±1%  [0402_R]  (hidden comment: 0402WGF220JTCE)
R24  描述: 2.2kΩ ±1%  [0402_R]  (hidden comment: AC0402FR-072K2L)
R25  描述: 22Ω ±1%  [0402_R]  (hidden comment: 0402WGF220JTCE)
R26  描述: 22Ω ±1%  [0402_R]  (hidden comment: 0402WGF220JTCE)
R27  描述: 22Ω ±1%  [0402_R]  (hidden comment: 0402WGF220JTCE)
R28  描述: 22Ω ±1%  [0402_R]  (hidden comment: 0402WGF220JTCE)
R29  描述: 22Ω ±1%  [0402_R]  (hidden comment: 0402WGF220JTCE)
U3  TPL740F28-5TR  [SOT-23-5]
U4  TPL740F28-5TR  [SOT-23-5]
U5  TPL740F18-5TR  [SOT-23-5]
U6  TPL740F18-5TR  [SOT-23-5]
U7  TPL740F12-5TR  [SOT-23-5]
U8  TPL740F12-5TR  [SOT-23-5]
U9  PT10A034UR  [DFN2510]
U10  PT10A034UR  [DFN2510]
U11  PT10A034UR  [DFN2510]
U12  PT10A034UR  [DFN2510]
U13  PT10A034UR  [DFN2510]
U14  PT10A034UR  [DFN2510]

### Ports
CSI_CAM0_PWREN (in), CSI_CAM1_PWREN (in), GND, I2C_SCL_MIPI_CAM0 (in), I2C_SCL_MIPI_CAM1 (in), I2C_SDA_MIPI_CAM0 (bidir), I2C_SDA_MIPI_CAM1 (bidir), MIPI_CSI0_RX_CLK_N (out), MIPI_CSI0_RX_CLK_P (out), MIPI_CSI0_RX_D0_N (out), MIPI_CSI0_RX_D0_P (out), MIPI_CSI0_RX_D1_N (out), MIPI_CSI0_RX_D1_P (out), MIPI_CSI0_RX_D2_N (out), MIPI_CSI0_RX_D2_P (out), MIPI_CSI0_RX_D3_N (out), MIPI_CSI0_RX_D3_P (out), MIPI_CSI1_RX_CLK_N (out), MIPI_CSI1_RX_CLK_P (out), MIPI_CSI1_RX_D0_N (out), MIPI_CSI1_RX_D0_P (out), MIPI_CSI1_RX_D1_N (out), MIPI_CSI1_RX_D1_P (out), MIPI_CSI1_RX_D2_N (out), MIPI_CSI1_RX_D2_P (out), MIPI_CSI1_RX_D3_N (out), MIPI_CSI1_RX_D3_P (out), MIPI_CSI_CAM0_CLKOUT (in), MIPI_CSI_CAM0_PDN (in), MIPI_CSI_CAM0_RST (in), MIPI_CSI_CAM1_CLKOUT (in), MIPI_CSI_CAM1_PDN (in), MIPI_CSI_CAM1_RST (in), VCC_1V8 (in), VCC_3V3 (in)

### Nets
GND: C15.1 C16.1 C17.1 C18.1 C19.1 C20.1 C21.1 C22.1 C23.1 C24.1 C25.1 C26.1 C27.1 C28.1 C29.1 C30.1 C31.1 C32.1 C33.1 C34.1 C35.1 C36.1 C37.1 C38.1 C39.1 C40.1 C41.1 C42.1 C43.1 C44.1 C45.1 C46.1 C47.1 C48.1 C49.1 C50.1 C51.1 C52.1 D5.1 D6.1 D7.1 D8.1 D9.1 D10.1 D11.1 D12.1 J3.7 J3.9 J3.12 J3.15 J3.18 J3.26 J3.28 J3.31 J3.34 J3.37 J3.41 J3.42 J4.7 J4.9 J4.12 J4.15 J4.18 J4.26 J4.28 J4.31 J4.34 J4.37 J4.41 J4.42 U3.2(GND) U4.2(GND) U5.2(GND) U6.2(GND) U7.2(GND) U8.2(GND) U9.3(GND) U9.8(GND) U10.3(GND) U10.8(GND) U11.3(GND) U11.8(GND) U12.3(GND) U12.8(GND) U13.3(GND) U13.8(GND) U14.3(GND) U14.8(GND) ; port GND  [project net CHIP_GND]
VCC_1V2_CAM0: C32.2 C49.2 C50.2 J3.23 U7.5(OUT)
VCC_1V2_CAM1: C34.2 C51.2 C52.2 J4.23 U8.5(OUT)
VCC_1V8: R16.2 R17.2 R18.1 R20.1 R22.1 R24.1 ; port VCC_1V8
VCC_1V8_CAM0: C24.2 C45.2 C46.2 J3.19 U5.5(OUT)
VCC_1V8_CAM1: C26.2 C47.2 C48.2 J4.19 U6.5(OUT)
VCC_2V8_CAM0: C16.2 C41.2 C42.2 J3.2 U3.5(OUT)
VCC_2V8_CAM1: C18.2 C43.2 C44.2 J4.2 U4.5(OUT)
VCC_3V3: C15.2 C17.2 C23.2 C25.2 C31.2 C33.2 U3.1(IN) U4.1(IN) U5.1(IN) U6.1(IN) U7.1(IN) U8.1(IN) ; port VCC_3V3  [project net VCC3V3]
CSI_CAM0_PWREN: R10.1 R12.1 R14.1 ; port CSI_CAM0_PWREN
CSI_CAM1_PWREN: R11.1 R13.1 R15.1 ; port CSI_CAM1_PWREN
I2C_SCL_MIPI_CAM0: R18.2 R19.1 ; port I2C_SCL_MIPI_CAM0
I2C_SCL_MIPI_CAM1: R20.2 R21.1 ; port I2C_SCL_MIPI_CAM1
I2C_SDA_MIPI_CAM0: R22.2 R23.1 ; port I2C_SDA_MIPI_CAM0
I2C_SDA_MIPI_CAM1: R24.2 R25.1 ; port I2C_SDA_MIPI_CAM1
MIPI_CSI0_I2C_SCL: D10.2 J3.5 R19.2
MIPI_CSI0_I2C_SDA: D12.2 J3.6 R23.2
MIPI_CSI0_PWDN/: D6.2 J3.24 R26.2
MIPI_CSI0_RST/: C39.2 D8.2 J3.25 R16.1 R28.2
MIPI_CSI0_RX_CLK_N: J3.30 U11.5(I/O) U11.6(NC) ; port MIPI_CSI0_RX_CLK_N
MIPI_CSI0_RX_CLK_P: J3.29 U11.4(I/O) U11.7(NC) ; port MIPI_CSI0_RX_CLK_P
MIPI_CSI0_RX_D0_N: J3.33 U13.2(I/O) U13.9(NC) ; port MIPI_CSI0_RX_D0_N
MIPI_CSI0_RX_D0_P: J3.32 U13.1(I/O) U13.10(NC) ; port MIPI_CSI0_RX_D0_P
MIPI_CSI0_RX_D1_N: J3.36 U13.5(I/O) U13.6(NC) ; port MIPI_CSI0_RX_D1_N
MIPI_CSI0_RX_D1_P: J3.35 U13.4(I/O) U13.7(NC) ; port MIPI_CSI0_RX_D1_P
MIPI_CSI0_RX_D2_N: J3.14 U9.2(I/O) U9.9(NC) ; port MIPI_CSI0_RX_D2_N
MIPI_CSI0_RX_D2_P: J3.13 U9.1(I/O) U9.10(NC) ; port MIPI_CSI0_RX_D2_P
MIPI_CSI0_RX_D3_N: J3.17 U9.5(I/O) U9.6(NC) ; port MIPI_CSI0_RX_D3_N
MIPI_CSI0_RX_D3_P: J3.16 U9.4(I/O) U9.7(NC) ; port MIPI_CSI0_RX_D3_P
MIPI_CSI1_I2C_SCL: D9.2 J4.5 R21.2
MIPI_CSI1_I2C_SDA: D11.2 J4.6 R25.2
MIPI_CSI1_PWDN/: D5.2 J4.24 R27.2
MIPI_CSI1_RST/: C40.2 D7.2 J4.25 R17.1 R29.2
MIPI_CSI1_RX_CLK_N: J4.30 U12.5(I/O) U12.6(NC) ; port MIPI_CSI1_RX_CLK_N
MIPI_CSI1_RX_CLK_P: J4.29 U12.4(I/O) U12.7(NC) ; port MIPI_CSI1_RX_CLK_P
MIPI_CSI1_RX_D0_N: J4.33 U14.2(I/O) U14.9(NC) ; port MIPI_CSI1_RX_D0_N
MIPI_CSI1_RX_D0_P: J4.32 U14.1(I/O) U14.10(NC) ; port MIPI_CSI1_RX_D0_P
MIPI_CSI1_RX_D1_N: J4.36 U14.5(I/O) U14.6(NC) ; port MIPI_CSI1_RX_D1_N
MIPI_CSI1_RX_D1_P: J4.35 U14.4(I/O) U14.7(NC) ; port MIPI_CSI1_RX_D1_P
MIPI_CSI1_RX_D2_N: J4.14 U10.2(I/O) U10.9(NC) ; port MIPI_CSI1_RX_D2_N
MIPI_CSI1_RX_D2_P: J4.13 U10.1(I/O) U10.10(NC) ; port MIPI_CSI1_RX_D2_P
MIPI_CSI1_RX_D3_N: J4.17 U10.5(I/O) U10.6(NC) ; port MIPI_CSI1_RX_D3_N
MIPI_CSI1_RX_D3_P: J4.16 U10.4(I/O) U10.7(NC) ; port MIPI_CSI1_RX_D3_P
MIPI_CSI_CAM0_CLKOUT: J3.27 U11.1(I/O) U11.10(NC) ; port MIPI_CSI_CAM0_CLKOUT
MIPI_CSI_CAM0_PDN: R26.1 ; port MIPI_CSI_CAM0_PDN
MIPI_CSI_CAM0_RST: R28.1 ; port MIPI_CSI_CAM0_RST
MIPI_CSI_CAM1_CLKOUT: J4.27 U12.1(I/O) U12.10(NC) ; port MIPI_CSI_CAM1_CLKOUT
MIPI_CSI_CAM1_PDN: R27.1 ; port MIPI_CSI_CAM1_PDN
MIPI_CSI_CAM1_RST: R29.1 ; port MIPI_CSI_CAM1_RST
NetC19_2: C19.2 U3.4(BP)
NetC20_2: C20.2 U4.4(BP)
NetC21_2: C21.2 R10.2 U3.3(EN)
NetC22_2: C22.2 R11.2 U4.3(EN)
NetC27_2: C27.2 U5.4(BP)
NetC28_2: C28.2 U6.4(BP)
NetC29_2: C29.2 R12.2 U5.3(EN)
NetC30_2: C30.2 R13.2 U6.3(EN)
NetC35_2: C35.2 U7.4(BP)
NetC36_2: C36.2 U8.4(BP)
NetC37_2: C37.2 R14.2 U7.3(EN)
NetC38_2: C38.2 R15.2 U8.3(EN)

Not connected (* = marked no-connect by the designer): J3 1* 3* 4* 8* 10* 11* 20* 21* 22* 38* 39* 40*; J4 1* 3* 4* 8* 10* 11* 20* 21* 22* 38* 39* 40*; U11 2(I/O)* 9(NC)*; U12 2(I/O)* 9(NC)*

### Layout directives
differential pair: MIPI_CSI0_RX_CLK_N, MIPI_CSI0_RX_CLK_P, MIPI_CSI0_RX_D0_N, MIPI_CSI0_RX_D0_P, MIPI_CSI0_RX_D1_N, MIPI_CSI0_RX_D1_P, MIPI_CSI0_RX_D2_N, MIPI_CSI0_RX_D2_P, MIPI_CSI0_RX_D3_N, MIPI_CSI0_RX_D3_P, MIPI_CSI1_RX_CLK_N, MIPI_CSI1_RX_CLK_P, MIPI_CSI1_RX_D0_N, MIPI_CSI1_RX_D0_P, MIPI_CSI1_RX_D1_N, MIPI_CSI1_RX_D1_P, MIPI_CSI1_RX_D2_N, MIPI_CSI1_RX_D2_P, MIPI_CSI1_RX_D3_N, MIPI_CSI1_RX_D3_P

### Notes on the sheet
- DPHY: Diff 100 Ohm ±10%
- 1.8V
- 3.3V
- 所有保护器件靠近端子入口处
- (near U13) U?、U?、U?的每个接地引
  脚需要至少三个地孔到地层
- (near U14) U?、U?、U?的每个接地引
  脚需要至少三个地孔到地层
- 产品名称
- 产品型号
- 设计人员
- 设计日期
- 审核人员
- 审核日期
- 图纸名称
- 图纸描述
- 图纸版本
- A3
- 广州灵眸科技有限公司

### Library data of the parts
C15 C17 C23 C25 C31 C33 = 0402 1uF ±10% 25V: as C213 on sheet 17.Other; 型号: CL05A105KA5NQNC; SuppliersPartNumber: C52923; 商品编号: SPZL000337
C16 C18 C24 C26 C32 C34 = 0402 4.7uF ±20% 10V: SPZL000339; 名称: 贴片电容; 厂商: SAMSUNG(三星); 封装: 0402; 工作温度: -55~85℃; 贴片和直插: SMD; 型号: CL05A475MP5NRNC; SuppliersPartNumber: C23733; 商品编号: SPZL000339
C19-C22 C27-C30 C35-C40 C42 C44 C46 C48 C50 C52 = 0402 100nF ±10% 16V: as C212 on sheet 17.Other; 型号: CL05B104KO5NNNC; SuppliersPartNumber: C1525; 商品编号: SPZL000259
C41 C43 C45 C47 C49 C51 = 0402 10uF ±20% 6.3V: as C211 on sheet 17.Other; 型号: CL05A106MQ5NUNC; SuppliersPartNumber: C15525; 商品编号: SPZL000269
D5-D12 = PT2C051U: SPZL001147; 名称: ESD; 贴片和直插: SMD; 厂商: 玛珂斯科技; 描述: Vrwm=5V, Cj=0.3pF; 工作温度: -55~125℃; 封装: DFN1006; 商品编号: SPZL001147; 型号: PT2C051U
J3 J4 = FPC 0.5MM 40P 翻盖式 H2.0mm 下接: SPZL000107; 名称: FPC座子; 厂商: JS(钜硕电子); 贴片和直插: SMD; 封装: SMD,P=0.5mm; 工作温度: -25~85℃; SuppliersPartNumber: C262674; 型号: AFC01-S40FCA-00; 商品编号: SPZL000107; 描述: FPC 0.5MM 40P 翻盖式 H2.0mm 下接
R10 R11 = 0402 51kΩ ±1%: SPZL000788; 封装: 0402; 厂商: UNI-ROYAL(厚声); 贴片和直插: SMD; 名称: 电阻; 工作温度: -55~155℃; SuppliersPartNumber: C25794; 型号: 0402WGF5102TCE; 商品编号: SPZL000788
R12 R13 R16 R17 = 0402 10kΩ ±1%: as R203 on sheet 17.Other; SuppliersPartNumber: C25744; 型号: 0402WGF1002TCE; 商品编号: SPZL000271
R14 R15 = 0402 1kΩ ±1%: as R3 on sheet 05.Audio; SuppliersPartNumber: C11702; 型号: 0402WGF1001TCE; 商品编号: SPZL000275
R18 R20 R22 R24 = 0402 2.2kΩ ±1%: SPZL000307; 封装: 0402; 厂商: YAGEO(国巨); 贴片和直插: SMD; 名称: 电阻; 工作温度: -55~155℃; SuppliersPartNumber: C144773; 型号: AC0402FR-072K2L; 商品编号: SPZL000307
R19 R21 R23 R25-R29 = 0402 22Ω ±1%: as R207 on sheet 17.Other; SuppliersPartNumber: C25092; 型号: 0402WGF220JTCE; 商品编号: SPZL000279
U3 U4 = TPL740F28-5TR: SPZL000631; 名称: 电源IC; 厂商: 3PEAK; 贴片和直插: SMD; 描述: LDO; 工作温度: -40~85℃; 封装: SOT-23-5; SuppliersPartNumber: *; 商品编号: SPZL000631; 型号: TPL740F28-5TR
U5 U6 = TPL740F18-5TR: SPZL000630; 名称: 电源IC; 厂商: 3PEAK; 贴片和直插: SMD; 描述: LDO; 工作温度: -40~85℃; 封装: SOT-23-5; SuppliersPartNumber: *; 商品编号: SPZL000630; 型号: TPL740F18-5TR
U7 U8 = TPL740F12-5TR: SPZL000632; 名称: 电源IC; 厂商: 3PEAK; 贴片和直插: SMD; 描述: LDO; 工作温度: -40~85℃; 封装: SOT-23-5; SuppliersPartNumber: *; 商品编号: SPZL000632; 型号: TPL740F12-5TR
U9-U14 = PT10A034UR: SPZL001146; 名称: ESD; 厂商: 玛珂斯科技; 贴片和直插: SMD; 描述: Vrwm=3.3V Cj=0.3pF; 工作温度: -55~125℃; 封装: DFN2510; 商品编号: SPZL001146; 型号: PT10A034UR

## Sheet 07.MIPI_DSI.SchDoc
size A4; CheckedBy: YPC; DocumentNumber: 7; Revision: V1.00; SheetNumber: 07; SheetTotal: 18; SheetName: MIPI_DSI; SheetDescribe: SheetDescribe; Designer: JOW; DesignDate: 2025-04-25; CheckedData: 2025-04-25
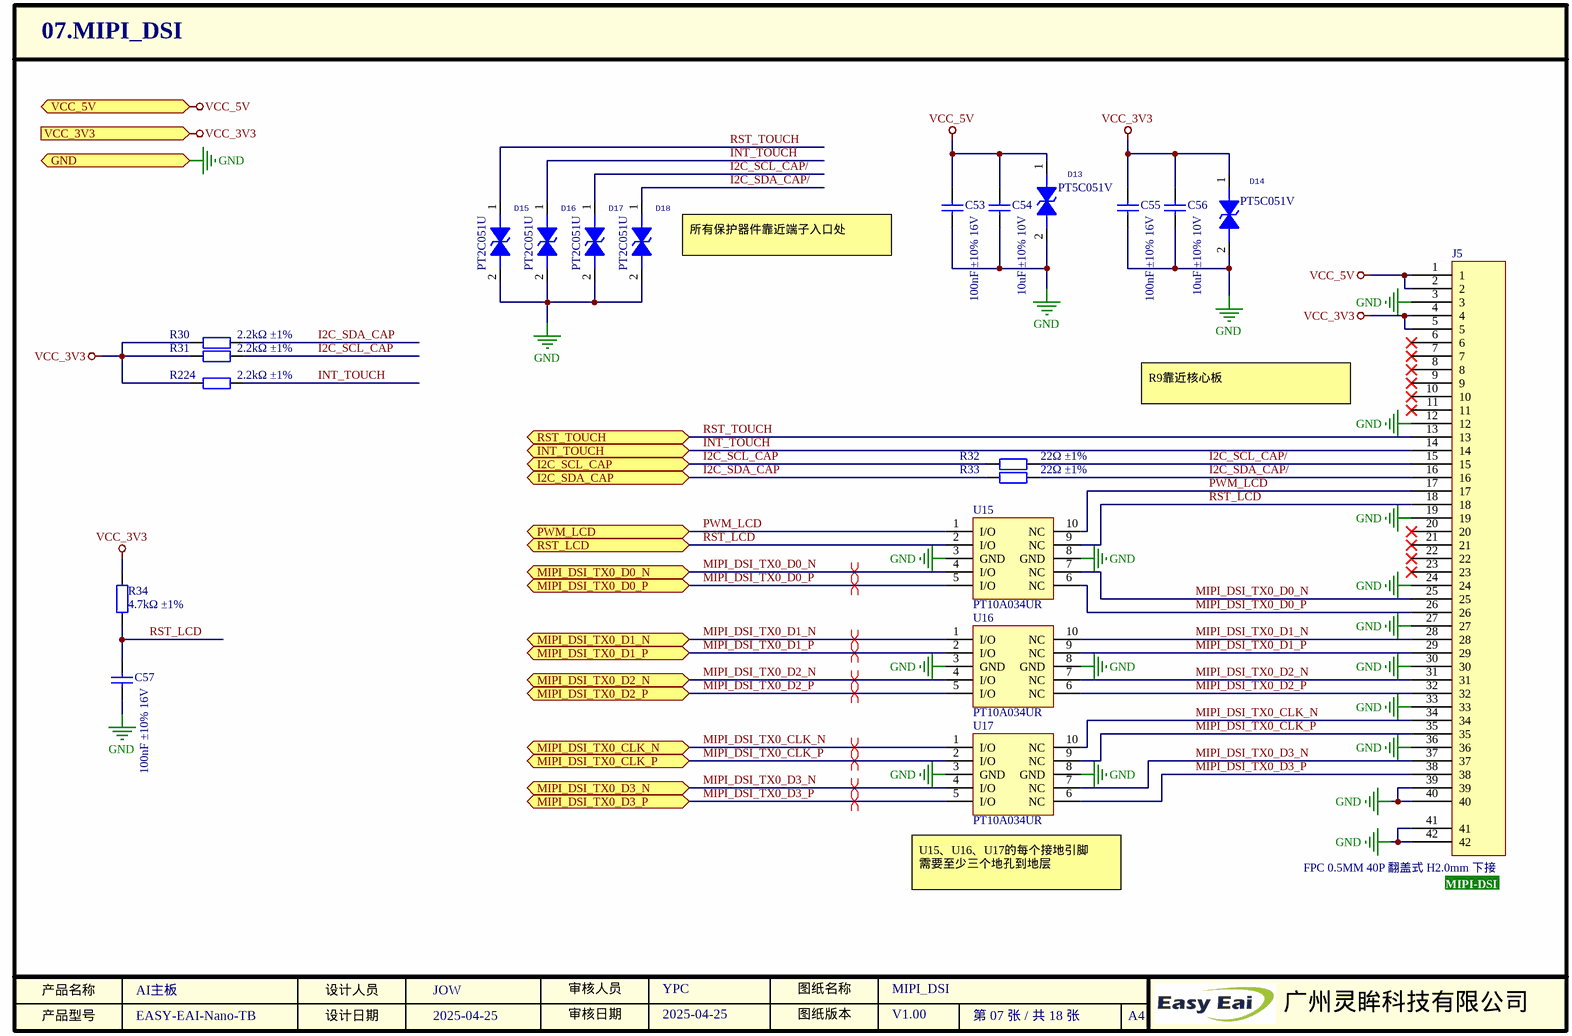
[diagram p9: 07.MIPI_DSI.SchDoc]

### Parts
C53  描述: 100nF ±10% 16V  [0402_C]  (hidden comment: CL05B104KO5NNNC)
C54  描述: 10uF ±10% 10V  [0603_C]  (hidden comment: CL10A106KP8NNNC)
C55  描述: 100nF ±10% 16V  [0402_C]  (hidden comment: CL05B104KO5NNNC)
C56  描述: 10uF ±10% 10V  [0603_C]  (hidden comment: CL10A106KP8NNNC)
C57  描述: 100nF ±10% 16V  [0402_C]  (hidden comment: CL05B104KO5NNNC)
D13  PT5C051V  [SOD-523]
D14  PT5C051V  [SOD-523]
D15  PT2C051U  [DFN1006]
D16  PT2C051U  [DFN1006]
D17  PT2C051U  [DFN1006]
D18  PT2C051U  [DFN1006]
J5  AFC01-S40FCA-00  [FFC0.5-40P]  (value not drawn)
R30  描述: 2.2kΩ ±1%  [0402_R]  (hidden comment: AC0402FR-072K2L)
R31  描述: 2.2kΩ ±1%  [0402_R]  (hidden comment: AC0402FR-072K2L)
R32  描述: 22Ω ±1%  [0402_R]  (hidden comment: 0402WGF220JTCE)
R33  描述: 22Ω ±1%  [0402_R]  (hidden comment: 0402WGF220JTCE)
R34  描述: 4.7kΩ ±1%  [0402_R]  (hidden comment: 0402WGF4701TCE)
R224  描述: 2.2kΩ ±1%  [0402_R]  (hidden comment: AC0402FR-072K2L)
U15  PT10A034UR  [DFN2510]
U16  PT10A034UR  [DFN2510]
U17  PT10A034UR  [DFN2510]

### Ports
GND, I2C_SCL_CAP, I2C_SDA_CAP, INT_TOUCH, MIPI_DSI_TX0_CLK_N, MIPI_DSI_TX0_CLK_P, MIPI_DSI_TX0_D0_N, MIPI_DSI_TX0_D0_P, MIPI_DSI_TX0_D1_N, MIPI_DSI_TX0_D1_P, MIPI_DSI_TX0_D2_N, MIPI_DSI_TX0_D2_P, MIPI_DSI_TX0_D3_N, MIPI_DSI_TX0_D3_P, PWM_LCD, RST_LCD, RST_TOUCH, VCC_3V3, VCC_5V

### Nets
GND: C53.1 C54.1 C55.1 C56.1 C57.1 D13.2 D14.2 D15.2 D16.2 D17.2 D18.2 J5.3 J5.12 J5.19 J5.24 J5.27 J5.30 J5.33 J5.36 J5.39 J5.40 J5.41 J5.42 U15.3(GND) U15.8(GND) U16.3(GND) U16.8(GND) U17.3(GND) U17.8(GND) ; port GND  [project net CHIP_GND]
VCC_3V3: C55.2 C56.2 D14.1 J5.4 J5.5 R30.1 R31.1 R34.2 R224.1 ; port VCC_3V3  [project net VCC3V3]
VCC_5V: C53.2 C54.2 D13.1 J5.1 J5.2 ; port VCC_5V
I2C_SCL_CAP: R31.2 R32.1 ; port I2C_SCL_CAP
I2C_SCL_CAP/: D17.1 J5.15 R32.2
I2C_SDA_CAP: R30.2 R33.1 ; port I2C_SDA_CAP
I2C_SDA_CAP/: D18.1 J5.16 R33.2
INT_TOUCH: D16.1 J5.14 R224.2 ; port INT_TOUCH
MIPI_DSI_TX0_CLK_N: J5.34 U17.1(I/O) U17.10(NC) ; port MIPI_DSI_TX0_CLK_N
MIPI_DSI_TX0_CLK_P: J5.35 U17.2(I/O) U17.9(NC) ; port MIPI_DSI_TX0_CLK_P
MIPI_DSI_TX0_D0_N: J5.25 U15.4(I/O) U15.7(NC) ; port MIPI_DSI_TX0_D0_N
MIPI_DSI_TX0_D0_P: J5.26 U15.5(I/O) U15.6(NC) ; port MIPI_DSI_TX0_D0_P
MIPI_DSI_TX0_D1_N: J5.28 U16.1(I/O) U16.10(NC) ; port MIPI_DSI_TX0_D1_N
MIPI_DSI_TX0_D1_P: J5.29 U16.2(I/O) U16.9(NC) ; port MIPI_DSI_TX0_D1_P
MIPI_DSI_TX0_D2_N: J5.31 U16.4(I/O) U16.7(NC) ; port MIPI_DSI_TX0_D2_N
MIPI_DSI_TX0_D2_P: J5.32 U16.5(I/O) U16.6(NC) ; port MIPI_DSI_TX0_D2_P
MIPI_DSI_TX0_D3_N: J5.37 U17.4(I/O) U17.7(NC) ; port MIPI_DSI_TX0_D3_N
MIPI_DSI_TX0_D3_P: J5.38 U17.5(I/O) U17.6(NC) ; port MIPI_DSI_TX0_D3_P
PWM_LCD: J5.17 U15.1(I/O) U15.10(NC) ; port PWM_LCD
RST_LCD: C57.2 J5.18 R34.1 U15.2(I/O) U15.9(NC) ; port RST_LCD
RST_TOUCH: D15.1 J5.13 ; port RST_TOUCH

Not connected (* = marked no-connect by the designer): J5 6* 7* 8* 9* 10* 11* 20* 21* 22* 23*

### Layout directives
differential pair: MIPI_DSI_TX0_CLK_N, MIPI_DSI_TX0_CLK_P, MIPI_DSI_TX0_D0_N, MIPI_DSI_TX0_D0_P, MIPI_DSI_TX0_D1_N, MIPI_DSI_TX0_D1_P, MIPI_DSI_TX0_D2_N, MIPI_DSI_TX0_D2_P, MIPI_DSI_TX0_D3_N, MIPI_DSI_TX0_D3_P

### Notes on the sheet
- 所有保护器件靠近端子入口处
- R9靠近核心板
- (near U17) U15、U16、U17的每个接地引脚
  需要至少三个地孔到地层
- (near J5) MIPI-DSI
- 产品名称
- 产品型号
- 设计人员
- 设计日期
- 审核人员
- 审核日期
- 图纸版本
- 图纸名称
- A4
- 广州灵眸科技有限公司

### Library data of the parts
C53 C55 C57 = 0402 100nF ±10% 16V: as C212 on sheet 17.Other; 型号: CL05B104KO5NNNC; SuppliersPartNumber: C1525; 商品编号: SPZL000259
C54 C56 = 0603 10uF ±10% 10V: as C216 on sheet 17.Other; 型号: CL10A106KP8NNNC; SuppliersPartNumber: C19702; 商品编号: SPZL000260
D13 D14 = PT5C051V: as D81 on sheet 17.Other; 封装: SOD-523; 商品编号: SPZL001155; 型号: PT5C051V
D15-D18 = PT2C051U: as D5 on sheet 06.MIPI_CSI_Camera; 封装: DFN1006; 商品编号: SPZL001147; 型号: PT2C051U
J5 = FPC 0.5MM 40P 翻盖式 H2.0mm 下接: as J3 on sheet 06.MIPI_CSI_Camera; SuppliersPartNumber: C262674; 型号: AFC01-S40FCA-00; 商品编号: SPZL000107; 描述: FPC 0.5MM 40P 翻盖式 H2.0mm 下接
R30 R31 R224 = 0402 2.2kΩ ±1%: as R18 on sheet 06.MIPI_CSI_Camera; SuppliersPartNumber: C144773; 型号: AC0402FR-072K2L; 商品编号: SPZL000307
R32 R33 = 0402 22Ω ±1%: as R207 on sheet 17.Other; SuppliersPartNumber: C25092; 型号: 0402WGF220JTCE; 商品编号: SPZL000279
R34 = 0402 4.7kΩ ±1%: SPZL000280; 封装: 0402; 厂商: UNI-ROYAL(厚声); 贴片和直插: SMD; 名称: 电阻; 工作温度: -55~155℃; SuppliersPartNumber: C25900; 型号: 0402WGF4701TCE; 商品编号: SPZL000280
U15-U17 = PT10A034UR: as U9 on sheet 06.MIPI_CSI_Camera; 封装: DFN2510; 商品编号: SPZL001146; 型号: PT10A034UR

## Sheet 10.TF.SchDoc
size A4; CheckedBy: YPC; DocumentNumber: 10; Revision: V1.00; SheetNumber: 10; SheetTotal: 18; SheetName: TF; SheetDescribe: TF卡; Designer: JOW; DesignDate: 2025-04-25; CheckedData: 2025-04-25
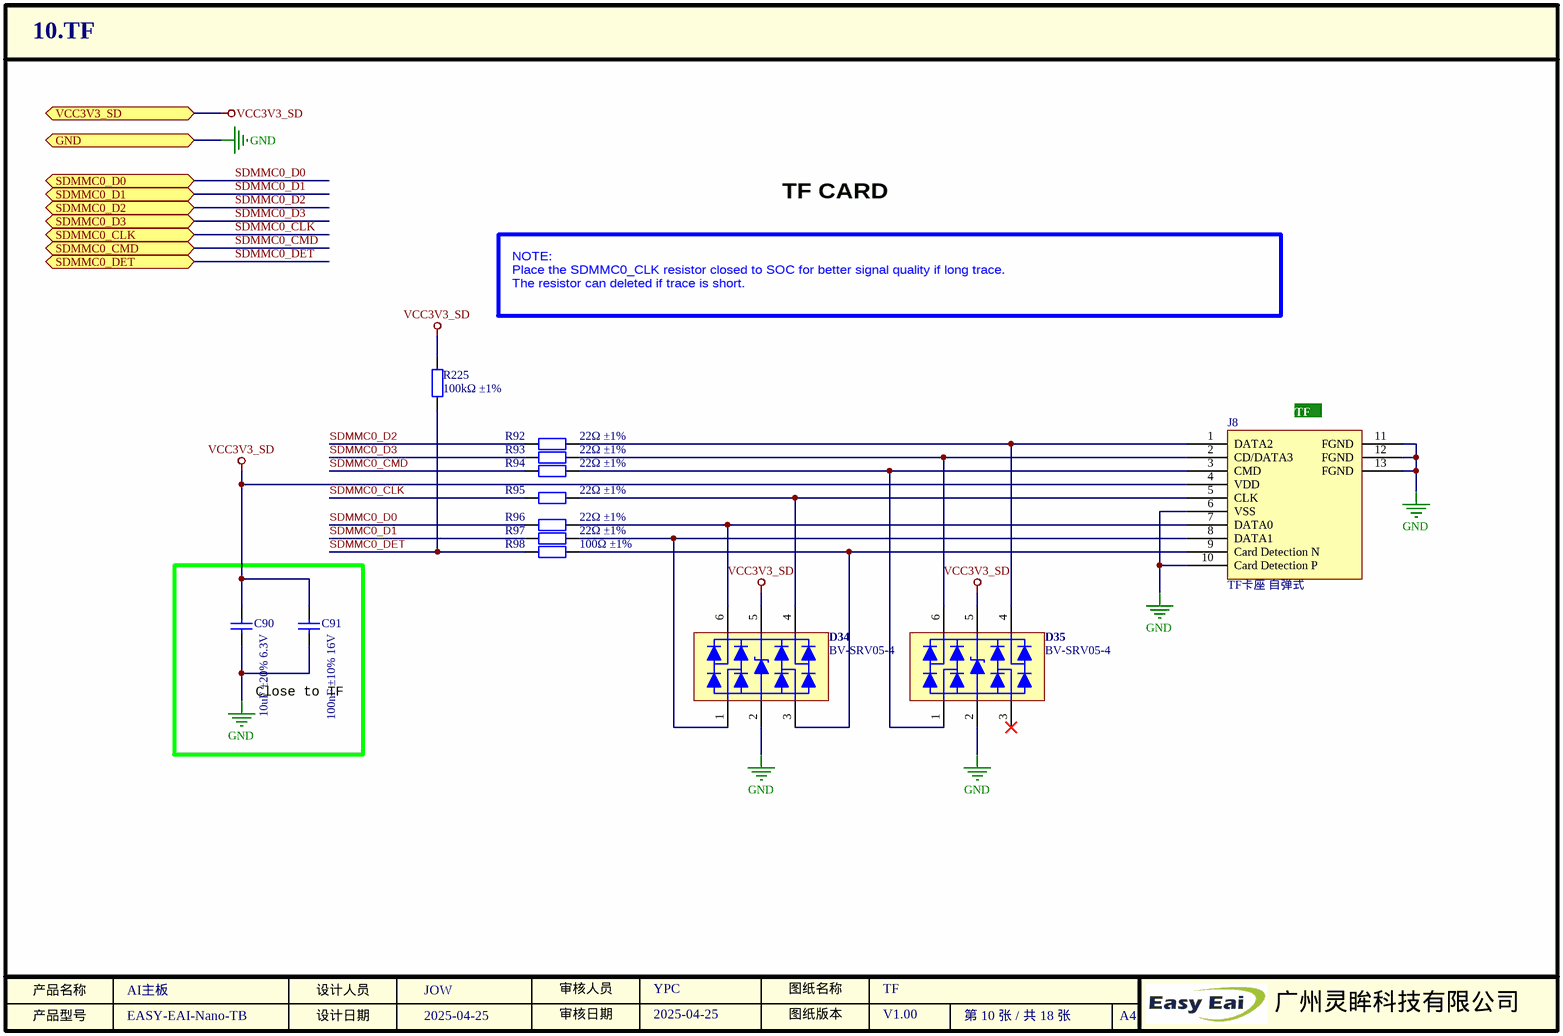
[diagram p10: 10.TF.SchDoc]

### Parts
C90  描述: 10uF ±20% 6.3V  [0402_C]  (hidden comment: CL05A106MQ5NUNC)
C91  描述: 100nF ±10% 16V  [0402_C]  (hidden comment: CL05B104KO5NNNC)
D34  BV-SRV05-4  [SOT-23-6]
D35  BV-SRV05-4  [SOT-23-6]
J8  TF-01A  [TF]  (value not drawn)
R92  描述: 22Ω ±1%  [0402_R]  (hidden comment: 0402WGF220JTCE)
R93  描述: 22Ω ±1%  [0402_R]  (hidden comment: 0402WGF220JTCE)
R94  描述: 22Ω ±1%  [0402_R]  (hidden comment: 0402WGF220JTCE)
R95  描述: 22Ω ±1%  [0402_R]  (hidden comment: 0402WGF220JTCE)
R96  描述: 22Ω ±1%  [0402_R]  (hidden comment: 0402WGF220JTCE)
R97  描述: 22Ω ±1%  [0402_R]  (hidden comment: 0402WGF220JTCE)
R98  描述: 100Ω ±1%  [0402_R]  (hidden comment: 0402WGF1000TCE)
R225  描述: 100kΩ ±1%  [0402_R]  (hidden comment: 0402WGF1003TCE)

### Blocks framed on the sheet
Close to TF: C90 C91

### Ports
GND, SDMMC0_CLK, SDMMC0_CMD, SDMMC0_D0, SDMMC0_D1, SDMMC0_D2, SDMMC0_D3, SDMMC0_DET, VCC3V3_SD

### Nets
GND: C90.1 C91.1 D34.2 D35.2 J8.6(VSS) J8.10(Card_Detection_P) J8.11(FGND) J8.12(FGND) J8.13(FGND) ; port GND  [project net CHIP_GND]
VCC3V3_SD: C90.2 C91.2 D34.5 D35.5 J8.4(VDD) R225.2 ; port VCC3V3_SD
SDMMC0_CLK: R95.1 ; port SDMMC0_CLK
SDMMC0_CMD: R94.1 ; port SDMMC0_CMD
SDMMC0_D0: R96.1 ; port SDMMC0_D0
SDMMC0_D1: R97.1 ; port SDMMC0_D1
SDMMC0_D2: R92.1 ; port SDMMC0_D2
SDMMC0_D3: R93.1 ; port SDMMC0_D3
SDMMC0_DET: R98.1 R225.1 ; port SDMMC0_DET
NetD34_1: D34.1 J8.8(DATA1) R97.2
NetD34_3: D34.3 J8.9(Card_Detection_N) R98.2
NetD34_4: D34.4 J8.5(CLK) R95.2
NetD34_6: D34.6 J8.7(DATA0) R96.2
NetD35_1: D35.1 J8.3(CMD) R94.2
NetD35_4: D35.4 J8.1(DATA2) R92.2
NetD35_6: D35.6 J8.2(CD/DATA3) R93.2

Not connected (* = marked no-connect by the designer): D35 3*

### Notes on the sheet
- TF CARD
- NOTE:
  Place the SDMMC0_CLK resistor closed to SOC for better signal quality if long trace.
  The resistor can deleted if trace is short.
- (near J8) TF
- 产品名称
- 产品型号
- 设计人员
- 设计日期
- 审核人员
- 审核日期
- 图纸版本
- 图纸名称
- A4
- 广州灵眸科技有限公司

### Library data of the parts
C90 = 0402 10uF ±20% 6.3V: as C211 on sheet 17.Other; 型号: CL05A106MQ5NUNC; SuppliersPartNumber: C15525; 商品编号: SPZL000269
C91 = 0402 100nF ±10% 16V: as C212 on sheet 17.Other; 型号: CL05B104KO5NNNC; SuppliersPartNumber: C1525; 商品编号: SPZL000259
D34 D35 = ESD BV-SRV05-4: SPZL000615; 名称: ESD; 厂商: Bencent(槟城); 贴片和直插: SMD; 描述: Vdrm=5V Cj=1.8pF; 工作温度: -55~125℃; 封装: SOT-23-6; SuppliersPartNumber: C409437; 商品编号: SPZL000615; 型号: BV-SRV05-4
J8 = TF卡座 自弹式: SPZL000144; 名称: TF卡座; 厂商: 韩国韩荣; 贴片和直插: SMD; 工作温度: -40~85℃; SuppliersPartNumber: C91145; 封装: SMD; 型号: TF-01A; 商品编号: SPZL000144; 描述: TF卡座 自弹式
R92-R97 = 0402 22Ω ±1%: as R207 on sheet 17.Other; SuppliersPartNumber: C25092; 型号: 0402WGF220JTCE; 商品编号: SPZL000279
R98 = 0402 100Ω ±1%: as R204 on sheet 17.Other; SuppliersPartNumber: C25076; 型号: 0402WGF1000TCE; 商品编号: SPZL000281
R225 = 0402 100kΩ ±1%: as R2 on sheet 05.Audio; SuppliersPartNumber: C25741; 型号: 0402WGF1003TCE; 商品编号: SPZL000282

## Sheet 11.WIFI_L-NLODB37.SchDoc
size A4; CheckedBy: YPC; DocumentNumber: 11; Revision: V1.00; SheetNumber: 11; SheetTotal: 18; SheetName: WIFI_L-NLEDB37-G5NN4; SheetDescribe: SheetDescribe; Designer: JOW; DesignDate: 2025-04-25; CheckedData: 2025-04-25; Rule: PcbType=ProtelPcb
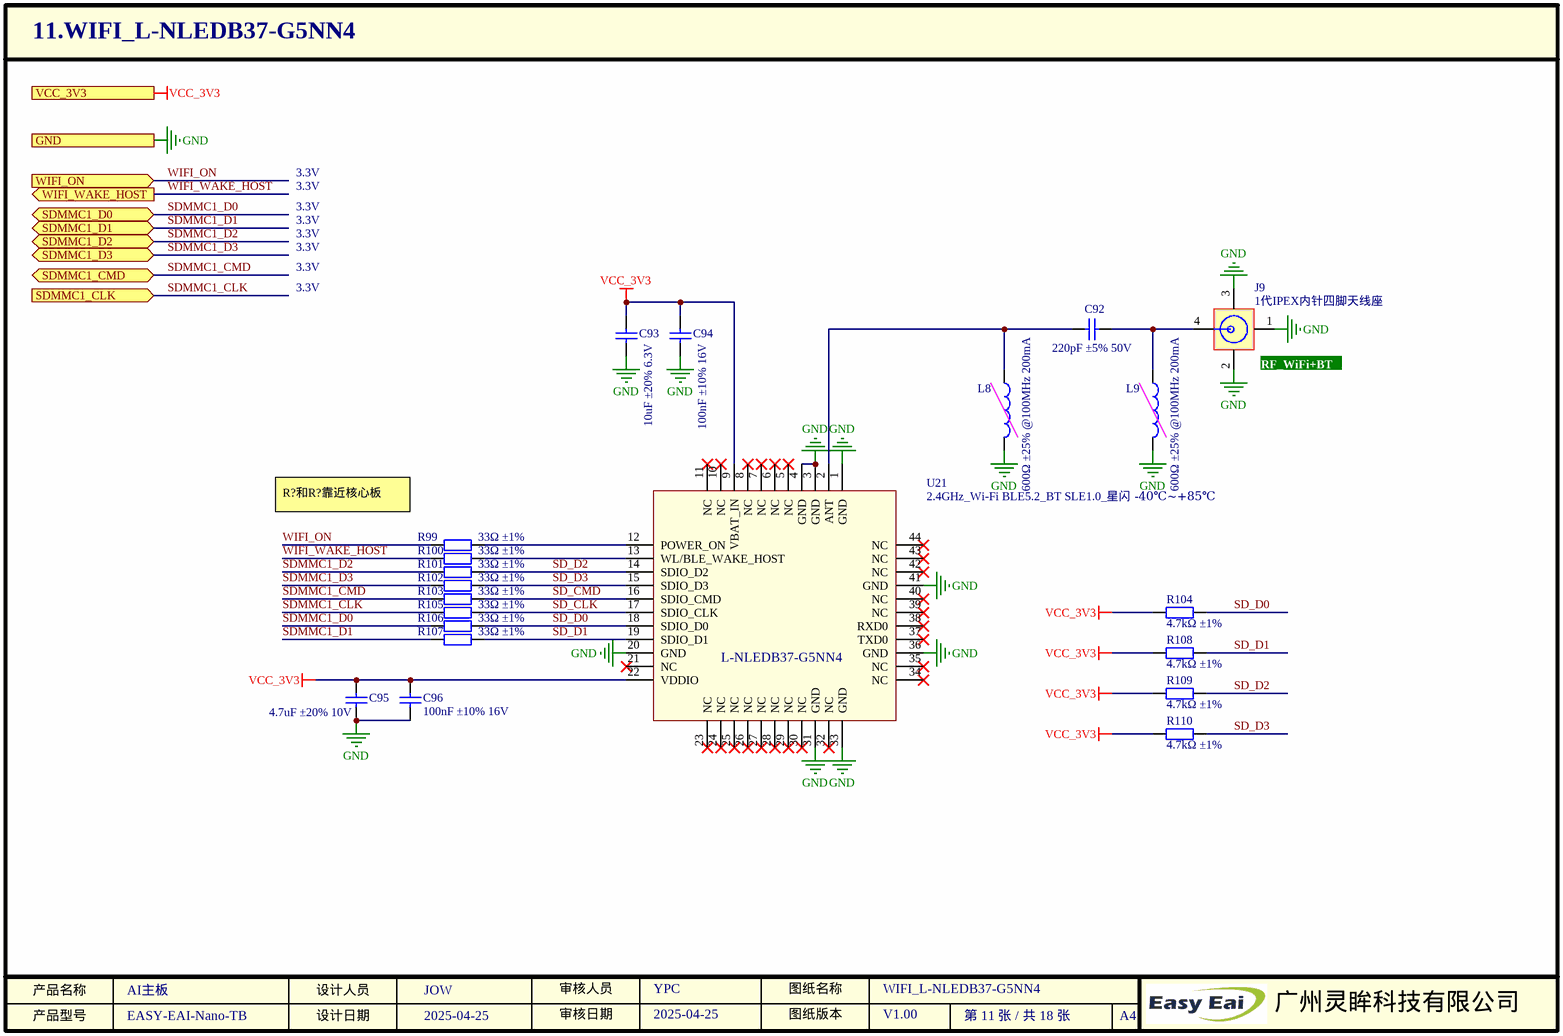
[diagram p11: 11.WIFI_L-NLODB37.SchDoc]

### Parts
C92  描述: 220pF ±5% 50V  [0402_C]  (hidden comment: GCM1555G1H221JA16D)
C93  描述: 10uF ±20% 6.3V  [0402_C]  (hidden comment: CL05A106MQ5NUNC)
C94  描述: 100nF ±10% 16V  [0402_C]  (hidden comment: CL05B104KO5NNNC)
C95  描述: 4.7uF ±20% 10V  [0402_C]  (hidden comment: CL05A475MP5NRNC)
C96  描述: 100nF ±10% 16V  [0402_C]  (hidden comment: CL05B104KO5NNNC)
J9  KH-IPEX-K501-29  [ANT-SMD_KH-IPEX-K501-29]  (value not drawn)
L8  CBW100505U601T  [0402_R]  (value not drawn)  (no BOM)
L9  CBW100505U601T  [0402_R]  (value not drawn)  (no BOM)
R99  描述: 33Ω ±1%  [0402_R]  (hidden comment: RC-02W33R0FT)
R100  描述: 33Ω ±1%  [0402_R]  (hidden comment: RC-02W33R0FT)
R101  描述: 33Ω ±1%  [0402_R]  (hidden comment: RC-02W33R0FT)
R102  描述: 33Ω ±1%  [0402_R]  (hidden comment: RC-02W33R0FT)
R103  描述: 33Ω ±1%  [0402_R]  (hidden comment: RC-02W33R0FT)
R104  描述: 4.7kΩ ±1%  [0402_R]  (hidden comment: 0402WGF4701TCE)
R105  描述: 33Ω ±1%  [0402_R]  (hidden comment: RC-02W33R0FT)
R106  描述: 33Ω ±1%  [0402_R]  (hidden comment: RC-02W33R0FT)
R107  描述: 33Ω ±1%  [0402_R]  (hidden comment: RC-02W33R0FT)
R108  描述: 4.7kΩ ±1%  [0402_R]  (hidden comment: 0402WGF4701TCE)
R109  描述: 4.7kΩ ±1%  [0402_R]  (hidden comment: 0402WGF4701TCE)
R110  描述: 4.7kΩ ±1%  [0402_R]  (hidden comment: 0402WGF4701TCE)
U21  描述: 2.4GHz_Wi-Fi BLE5.2_BT SLE1.0_星闪 -40℃~+85℃  [L-NLEDB37-G5NN4_SMT]  (hidden comment: L-NLEDB37-G5NN4)

### Ports
GND, SDMMC1_CLK (in), SDMMC1_CMD (bidir), SDMMC1_D0 (bidir), SDMMC1_D1 (bidir), SDMMC1_D2 (bidir), SDMMC1_D3 (bidir), VCC_3V3 (in), WIFI_ON (in), WIFI_WAKE_HOST (out)

### Nets
GND: C93.1 C94.1 C95.1 C96.1 J9.1 J9.2 J9.3 L8.2 L9.2 U21.1(GND) U21.3(GND) U21.4(GND) U21.20(GND) U21.31(GND) U21.33(GND) U21.36(GND) U21.41(GND) ; port GND  [project net CHIP_GND]
VCC_3V3: C93.2 C94.2 C95.2 C96.2 R104.1 R108.1 R109.1 R110.1 U21.9(VBAT_IN) U21.22(VDDIO) ; port VCC_3V3  [project net VCC3V3]
SD_CLK: R105.2 U21.17(SDIO_CLK)
SD_CMD: R103.2 U21.16(SDIO_CMD)
SD_D0: R104.2 R106.2 U21.18(SDIO_D0)
SD_D1: R107.2 R108.2 U21.19(SDIO_D1)
SD_D2: R101.2 R109.2 U21.14(SDIO_D2)
SD_D3: R102.2 R110.2 U21.15(SDIO_D3)
SDMMC1_CLK: R105.1 ; port SDMMC1_CLK
SDMMC1_CMD: R103.1 ; port SDMMC1_CMD
SDMMC1_D0: R106.1 ; port SDMMC1_D0
SDMMC1_D1: R107.1 ; port SDMMC1_D1
SDMMC1_D2: R101.1 ; port SDMMC1_D2
SDMMC1_D3: R102.1 ; port SDMMC1_D3
WIFI_ON: R99.1 ; port WIFI_ON
WIFI_WAKE_HOST: R100.1 ; port WIFI_WAKE_HOST
NetC92_1: C92.1 L8.1 U21.2(ANT)
NetC92_2: C92.2 J9.4 L9.1
NetR99_2: R99.2 U21.12(POWER_ON)
NetR100_2: R100.2 U21.13(WL/BLE_WAKE_HOST)

Not connected (* = marked no-connect by the designer): U21 5(NC)* 6(NC)* 7(NC)* 8(NC)* 10(NC)* 11(NC)* 21(NC)* 23(NC)* 24(NC)* 25(NC)* 26(NC)* 27(NC)* 28(NC)* 29(NC)* 30(NC)* 32(NC)* 34(NC)* 35(NC)* 37(TXD0)* 38(RXD0)* 39(NC)* 40(NC)* 42(NC)* 43(NC)* 44(NC)*

### Notes on the sheet
- 3.3V
- (near J9) RF_WiFi+BT
- R?和R?靠近核心板
- 产品名称
- 产品型号
- 设计人员
- 设计日期
- 审核人员
- 审核日期
- 图纸版本
- 图纸名称
- A4
- 广州灵眸科技有限公司

### Library data of the parts
C92 = 0402 220pF ±5% 50V: as C13 on sheet 05.Audio; 型号: GCM1555G1H221JA16D; SuppliersPartNumber: C1517776; 商品编号: SPZL000318
C93 = 0402 10uF ±20% 6.3V: as C211 on sheet 17.Other; 型号: CL05A106MQ5NUNC; SuppliersPartNumber: C15525; 商品编号: SPZL000269
C94 C96 = 0402 100nF ±10% 16V: as C212 on sheet 17.Other; 型号: CL05B104KO5NNNC; SuppliersPartNumber: C1525; 商品编号: SPZL000259
C95 = 0402 4.7uF ±20% 10V: as C16 on sheet 06.MIPI_CSI_Camera; 型号: CL05A475MP5NRNC; SuppliersPartNumber: C23733; 商品编号: SPZL000339
J9 = 1代IPEX内针四脚天线座: SPZL001156; 名称: RF连接器; 贴片和直插: SMD; 厂商: kinghelm(金航标); 封装: SMD; SuppliersPartNumber: C411563; 型号: KH-IPEX-K501-29; 商品编号: SPZL001156; 工作温度: *; 描述: 1代IPEX内针四脚天线座
L8 L9 = 600Ω ±25% @100MHz 200mA: SPZL000058; 名称: 磁珠; 封装: 0402; 厂商: FH(风华); 贴片和直插: SMD; 工作温度: -40~85℃; SuppliersPartNumber: C124083; 型号: CBW100505U601T; 商品编号: SPZL000058; 描述: 600Ω ±25% @100MHz 200mA
R99-R103 R105-R107 = 0402 33Ω ±1%: SPZL000302; 封装: 0402; 厂商: FH(风华); 贴片和直插: SMD; 名称: 电阻; 工作温度: -55~155℃; SuppliersPartNumber: C140161; 型号: RC-02W33R0FT; 商品编号: SPZL000302
R104 R108-R110 = 0402 4.7kΩ ±1%: as R34 on sheet 07.MIPI_DSI; SuppliersPartNumber: C25900; 型号: 0402WGF4701TCE; 商品编号: SPZL000280
U21 = L-NLEDB37-G5NN4: SPZL001091; 名称: IC; 封装: QFN-44(12x12); 贴片和直插: SMD; 厂商: 利尔达; 工作温度: -40℃~+85℃; 型号: L-NLEDB37-G5NN4; 商品编号: SPZL001091